# EAGLE design midimixer-channel-rev2 (EAGLE 7.3.0)

## Sheet 1 of 2
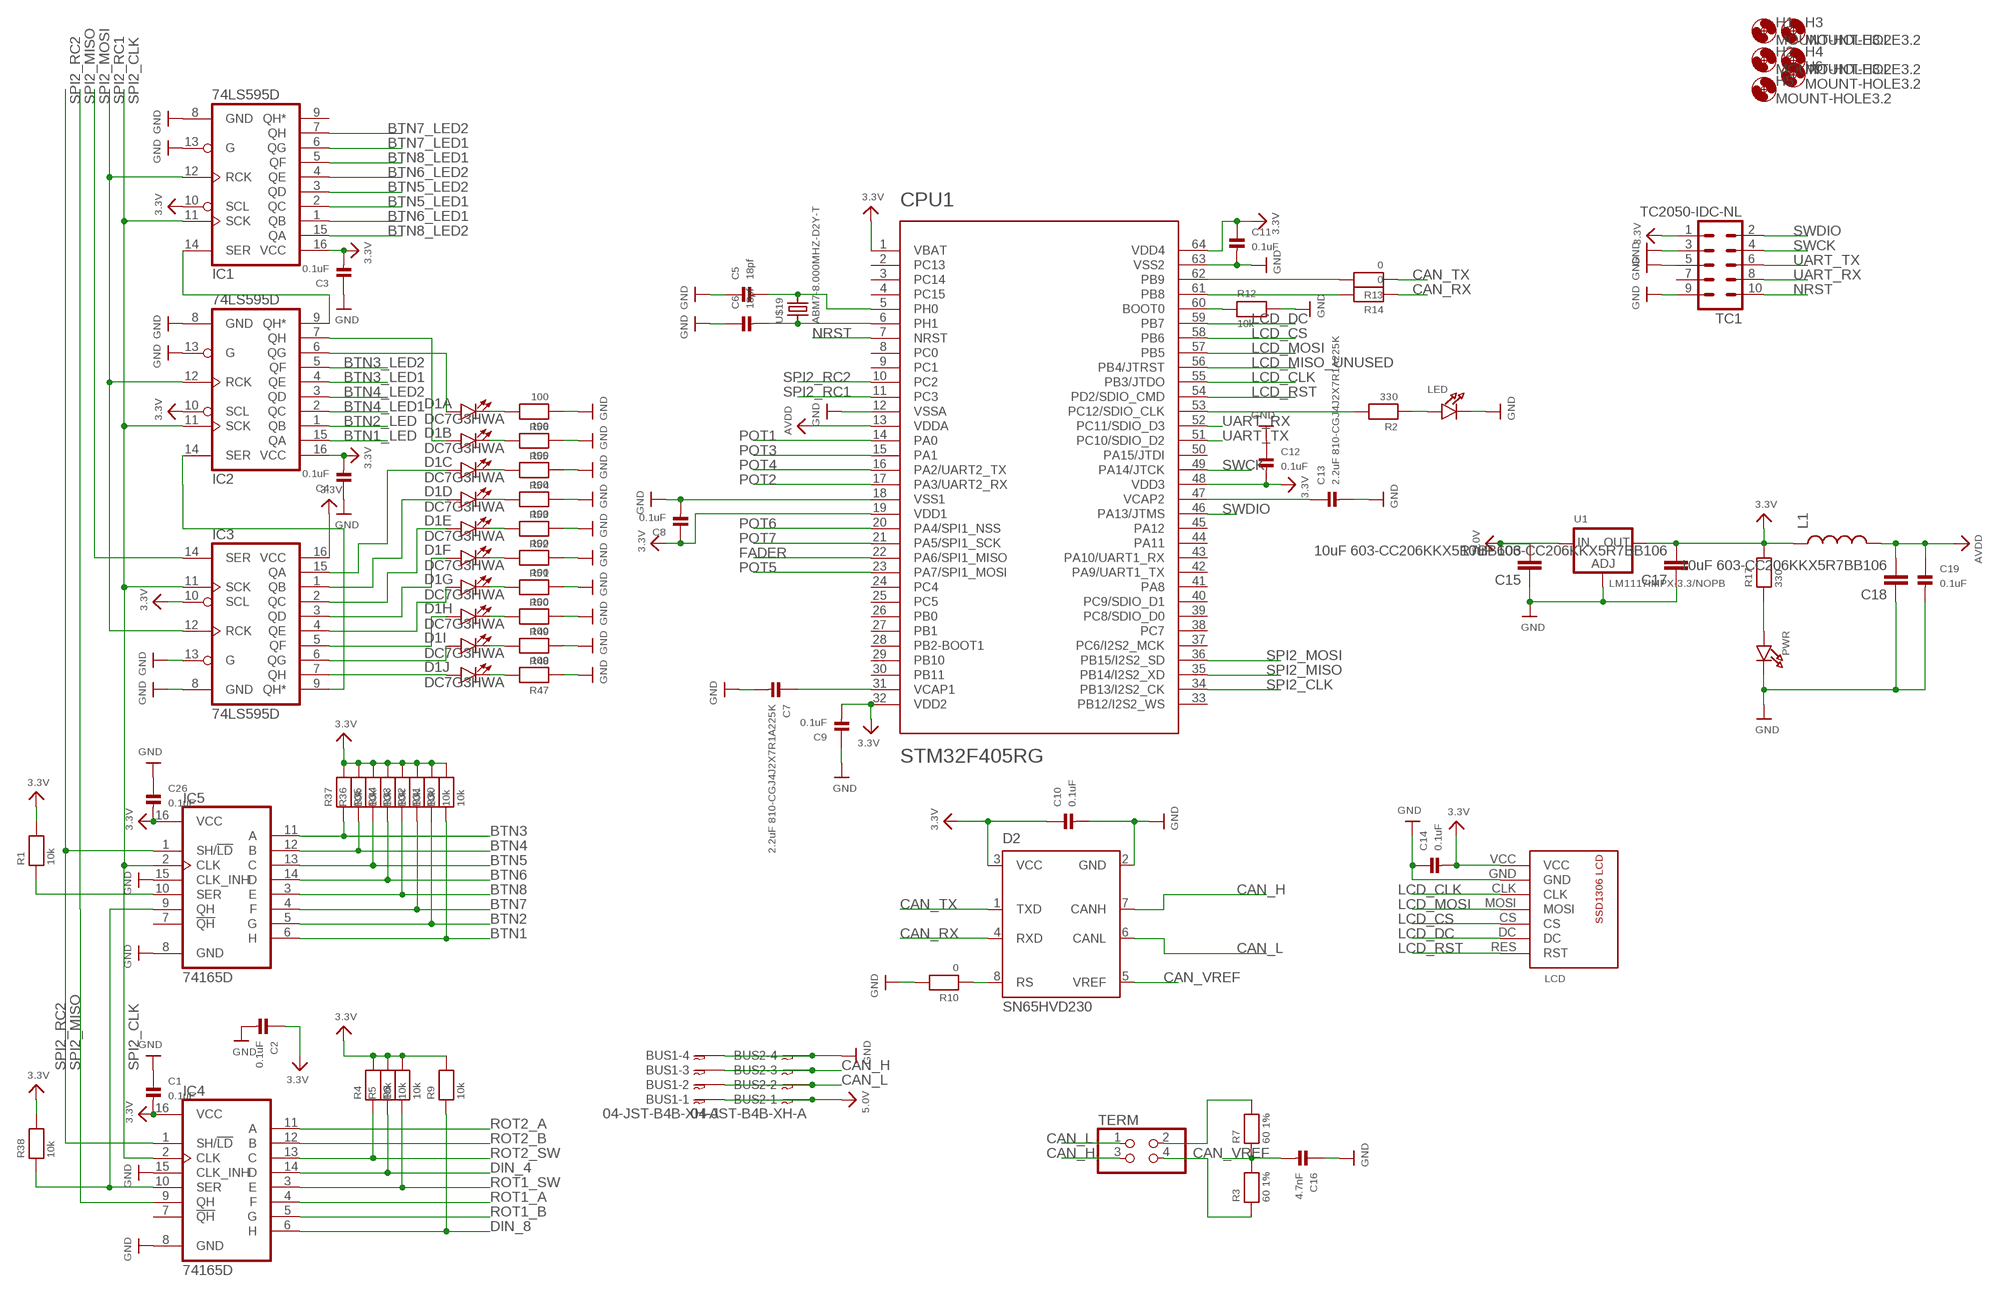
[diagram p0: schematic, sheet 1]

### Parts
BUS1  04-JST-B4B-XH-A  [B4B-XH]
BUS2  04-JST-B4B-XH-A  [B4B-XH]
C1  0.1uF  CAP_CERAMIC0603  [0603]
C2  0.1uF  CAP_CERAMIC0603  [0603]
C3  0.1uF  CAP_CERAMIC0603  [0603]
C4  0.1uF  CAP_CERAMIC0603  [0603]
C5  18pf  CAP_CERAMIC0603  [0603]
C6  18pf  CAP_CERAMIC0603  [0603]
C7  2.2uF 810-CGJ4J2X7R1A225K  CAP_CERAMIC0805  [0805]
C8  0.1uF  CAP_CERAMIC0603  [0603]
C9  0.1uF  CAP_CERAMIC0603  [0603]
C10  0.1uF  CAP_CERAMIC0603  [0603]
C11  0.1uF  CAP_CERAMIC0603  [0603]
C12  0.1uF  CAP_CERAMIC0603  [0603]
C13  2.2uF 810-CGJ4J2X7R1A225K  CAP_CERAMIC0805  [0805]
C14  0.1uF  CAP_CERAMIC0603  [0603]
C15  10uF 603-CC206KKX5R7BB106  CAP1206  [1206]
C16  4.7nF  CAP_CERAMIC0603  [0603]
C17  10uF 603-CC206KKX5R7BB106  CAP1206  [1206]
C18  10uF 603-CC206KKX5R7BB106  CAP1206  [1206]
C19  0.1uF  CAP_CERAMIC0603  [0603]
C26  0.1uF  CAP_CERAMIC0603  [0603]
CPU1  STM32F405RG  [TQFP64]
D1  DC7G3HWA  LED_BARGRAPH_10  [LED_BARGAPH_10]
D2  SN65HVD230  [SO8]
H1  MOUNT-HOLE3.2  [3,2]
H2  MOUNT-HOLE3.2  [3,2]
H3  MOUNT-HOLE3.2  [3,2]
H4  MOUNT-HOLE3.2  [3,2]
H5  MOUNT-HOLE3.2  [3,2]
H6  MOUNT-HOLE3.2  [3,2]
IC1  74LS595D  [SO16]
IC2  74LS595D  [SO16]
IC3  74LS595D  [SO16]
IC4  74165D  [SO16]
IC5  74165D  [SO16]
L1  INDUCTOR0805  [0805]
LCD  SSD1306-7PINWITHOUT-HOLES  [SSD1306-7PIN-NO-HOLES]
LED  LED0603  [CHIPLED_0603]
PWR  LED0603  [CHIPLED_0603]
R1  10k  RESISTOR_0603  [_0603]
R2  330  RESISTOR0603  [0603]
R3  60 1%  RESISTOR0603  [0603]
R4  10k  RESISTOR_0603  [_0603]
R5  10k  RESISTOR_0603  [_0603]
R6  10k  RESISTOR_0603  [_0603]
R7  60 1%  RESISTOR0603  [0603]
R9  10k  RESISTOR_0603  [_0603]
R10  0  RESISTOR_0603  [_0603]
R12  10k  RESISTOR_0603  [_0603]
R13  0  RESISTOR_0603  [_0603]
R14  0  RESISTOR_0603  [_0603]
R17  330  RESISTOR0603  [0603]
R30  10k  RESISTOR_0603  [_0603]
R31  10k  RESISTOR_0603  [_0603]
R32  10k  RESISTOR_0603  [_0603]
R33  10k  RESISTOR_0603  [_0603]
R34  10k  RESISTOR_0603  [_0603]
R35  10k  RESISTOR_0603  [_0603]
R36  10k  RESISTOR_0603  [_0603]
R37  10k  RESISTOR_0603  [_0603]
R38  10k  RESISTOR_0603  [_0603]
R47  100  RESISTOR_0603  [_0603]
R48  100  RESISTOR_0603  [_0603]
R49  100  RESISTOR_0603  [_0603]
R50  100  RESISTOR_0603  [_0603]
R51  100  RESISTOR_0603  [_0603]
R52  100  RESISTOR_0603  [_0603]
R53  100  RESISTOR_0603  [_0603]
R54  100  RESISTOR_0603  [_0603]
R55  100  RESISTOR_0603  [_0603]
R56  100  RESISTOR_0603  [_0603]
TC1  TC2050-IDC-NL  [TC2050-IDC-NL]
TERM  PINHD-2X2  [2X02]
U1  LM1117IMPX-3.3/NOPB  LM1117SOT223-REFLOW  [SOT223-R]
U$19  ABM7-8.000MHZ-D2Y-T  [ABM7-8.000MHZ-D2Y-T]

### Nets
3.3V: C1.2 C2.1 C3.2 C4.2 C8.1 C9.2 C10.1 C11.1 C12.2 C14.2 C17.2 C26.2 CPU1.1(VBAT) CPU1.19(VDD1) CPU1.32(VDD2) CPU1.48(VDD3) CPU1.64(VDD4) D2.3(VCC) IC1.10(SCL) IC1.16(VCC) IC2.10(SCL) IC2.16(VCC) IC3.10(SCL) IC3.16(VCC) IC4.16(VCC) IC5.16(VCC) L1.1 LCD.VCC R1.2 R4.2 R5.2 R6.2 R9.2 R17.2 R30.2 R31.2 R32.2 R33.2 R34.2 R35.2 R36.2 R37.2 R38.2 TC1.1 U1.2(OUT) ; also sheet 2
5.0V: BUS1.P$1 BUS2.P$1 C15.2 U1.3(IN) ; also sheet 2
AVDD: C18.2 C19.1 CPU1.13(VDDA) L1.2
BTN1: IC5.6(H) R30.1 ; also sheet 2
BTN1_LED: IC2.15(QA) ; also sheet 2
BTN2: IC5.5(G) R31.1 ; also sheet 2
BTN2_LED: IC2.1(QB) ; also sheet 2
BTN3: IC5.11(A) R37.1 ; also sheet 2
BTN3_LED1: IC2.4(QE) ; also sheet 2
BTN3_LED2: IC2.5(QF) ; also sheet 2
BTN4: IC5.12(B) R36.1 ; also sheet 2
BTN4_LED1: IC2.2(QC) ; also sheet 2
BTN4_LED2: IC2.3(QD) ; also sheet 2
BTN5: IC5.13(C) R35.1 ; also sheet 2
BTN5_LED1: IC1.2(QC) ; also sheet 2
BTN5_LED2: IC1.3(QD) ; also sheet 2
BTN6: IC5.14(D) R34.1 ; also sheet 2
BTN6_LED1: IC1.1(QB) ; also sheet 2
BTN6_LED2: IC1.4(QE) ; also sheet 2
BTN7: IC5.4(F) R32.1 ; also sheet 2
BTN7_LED1: IC1.6(QG) ; also sheet 2
BTN7_LED2: IC1.7(QH) ; also sheet 2
BTN8: IC5.3(E) R33.1 ; also sheet 2
BTN8_LED1: IC1.5(QF) ; also sheet 2
BTN8_LED2: IC1.15(QA) ; also sheet 2
CAN_H: BUS1.P$3 BUS2.P$3 D2.7(CANH) TERM.3
CAN_L: BUS1.P$2 BUS2.P$2 D2.6(CANL) TERM.1
CAN_RX: D2.4(RXD) R14.1
CAN_TX: D2.1(TXD) R13.1
CAN_VREF: C16.2 D2.5(VREF) R3.2 R7.1
DIN_4: IC4.14(D) R5.1
DIN_8: IC4.6(H) R9.1
FADER: CPU1.22(PA6/SPI1_MISO) ; also sheet 2
GND: BUS1.P$4 BUS2.P$4 C1.1 C2.2 C3.1 C4.1 C5.1 C6.1 C7.2 C8.2 C9.1 C10.2 C11.2 C12.1 C13.2 C14.1 C15.1 C16.1 C17.1 C18.1 C19.2 C26.1 CPU1.12(VSSA) CPU1.18(VSS1) CPU1.63(VSS2) D2.2(GND) IC1.8(GND) IC1.13(G) IC2.8(GND) IC2.13(G) IC3.8(GND) IC3.13(G) IC4.8(GND) IC4.15(CLK_INH) IC5.8(GND) IC5.15(CLK_INH) LCD.GND LED.C PWR.C R10.2 R12.2 R47.1 R48.1 R49.1 R50.1 R51.1 R52.1 R53.1 R54.1 R55.1 R56.1 TC1.3 TC1.5 TC1.9 U1.1(ADJ) ; also sheet 2
LCD_CLK: CPU1.55(PB3/JTDO) LCD.CLK
LCD_CS: CPU1.58(PB6) LCD.CS
LCD_DC: CPU1.59(PB7) LCD.DC
LCD_MISO_UNUSED: CPU1.56(PB4/JTRST)
LCD_MOSI: CPU1.57(PB5) LCD.MOSI
LCD_RST: CPU1.54(PD2/SDIO_CMD) LCD.RES(RST)
N$1: C6.2 CPU1.6(PH1) U$19.P$1
N$2: C5.2 CPU1.5(PH0) U$19.P$2
N$3: C13.1 CPU1.47(VCAP2)
N$4: C7.1 CPU1.31(VCAP1)
N$5: PWR.A R17.1
N$6: CPU1.60(BOOT0) R12.1
N$7: D1.5(E:A) IC3.2(QC)
N$8: D1.2(B:A) IC2.7(QH)
N$11: D1.1(A:A) IC2.6(QG)
N$12: IC1.14(SER) IC2.9(QH*)
N$13: CPU1.62(PB9) R13.2
N$14: D1.11(J:C) R47.2
N$15: D1.12(I:C) R48.2
N$16: D1.13(H:C) R49.2
N$17: D1.14(G:C) R50.2
N$18: D1.15(F:C) R51.2
N$19: D1.16(E:C) R52.2
N$20: D1.17(D:C) R53.2
N$21: D1.18(C:C) R54.2
N$22: D1.19(B:C) R55.2
N$23: D1.20(A:C) R56.2
N$26: IC4.10(SER) IC5.9(QH) R38.1
N$27: CPU1.61(PB8) R14.2
N$28: IC5.10(SER) R1.1
N$31: LED.A R2.1
N$38: D1.10(J:A) IC3.7(QH)
N$41: D1.9(I:A) IC3.6(QG)
N$42: D1.8(H:A) IC3.5(QF)
N$43: CPU1.53(PC12/SDIO_CLK) R2.2
N$46: R7.2 TERM.2
N$47: R3.1 TERM.4
N$52: D1.7(G:A) IC3.4(QE)
N$53: D1.6(F:A) IC3.3(QD)
N$55: D1.4(D:A) IC3.1(QB)
N$56: D1.3(C:A) IC3.15(QA)
N$57: IC2.14(SER) IC3.9(QH*)
N$73: D2.8(RS) R10.1
NRST: CPU1.7(NRST) TC1.10
POT1: CPU1.14(PA0) ; also sheet 2
POT2: CPU1.17(PA3/UART2_RX) ; also sheet 2
POT3: CPU1.15(PA1) ; also sheet 2
POT4: CPU1.16(PA2/UART2_TX) ; also sheet 2
POT5: CPU1.23(PA7/SPI1_MOSI) ; also sheet 2
POT6: CPU1.20(PA4/SPI1_NSS) ; also sheet 2
POT7: CPU1.21(PA5/SPI1_SCK) ; also sheet 2
ROT1_A: IC4.4(F) ; also sheet 2
ROT1_B: IC4.5(G) ; also sheet 2
ROT1_SW: IC4.3(E) R6.1 ; also sheet 2
ROT2_A: IC4.11(A) ; also sheet 2
ROT2_B: IC4.12(B) ; also sheet 2
ROT2_SW: IC4.13(C) R4.1 ; also sheet 2
SPI2_CLK: CPU1.34(PB13/I2S2_CK) IC1.11(SCK) IC2.11(SCK) IC3.11(SCK) IC4.2(CLK) IC5.2(CLK)
SPI2_MISO: CPU1.35(PB14/I2S2_XD) IC4.9(QH)
SPI2_MOSI: CPU1.36(PB15/I2S2_SD) IC3.14(SER)
SPI2_RC1: CPU1.11(PC3) IC1.12(RCK) IC2.12(RCK) IC3.12(RCK)
SPI2_RC2: CPU1.10(PC2) IC4.1(SH/!LD) IC5.1(SH/!LD)
SWCK: CPU1.49(PA14/JTCK) TC1.4
SWDIO: CPU1.46(PA13/JTMS) TC1.2
UART_RX: CPU1.52(PC11/SDIO_D3) TC1.8
UART_TX: CPU1.51(PC10/SDIO_D2) TC1.6
Unconnected: CPU1.2(PC13) CPU1.3(PC14) CPU1.4(PC15) CPU1.8(PC0) CPU1.9(PC1) CPU1.24(PC4) CPU1.25(PC5) CPU1.26(PB0) CPU1.27(PB1) CPU1.28(PB2-BOOT1) CPU1.29(PB10) CPU1.30(PB11) CPU1.33(PB12/I2S2_WS) CPU1.37(PC6/I2S2_MCK) CPU1.38(PC7) CPU1.39(PC8/SDIO_D0) CPU1.40(PC9/SDIO_D1) CPU1.41(PA8) CPU1.42(PA9/UART1_TX) CPU1.43(PA10/UART1_RX) CPU1.44(PA11) CPU1.45(PA12) CPU1.50(PA15/JTDI) IC1.9(QH*) IC4.7(!QH) IC5.7(!QH) TC1.7

## Sheet 2 of 2
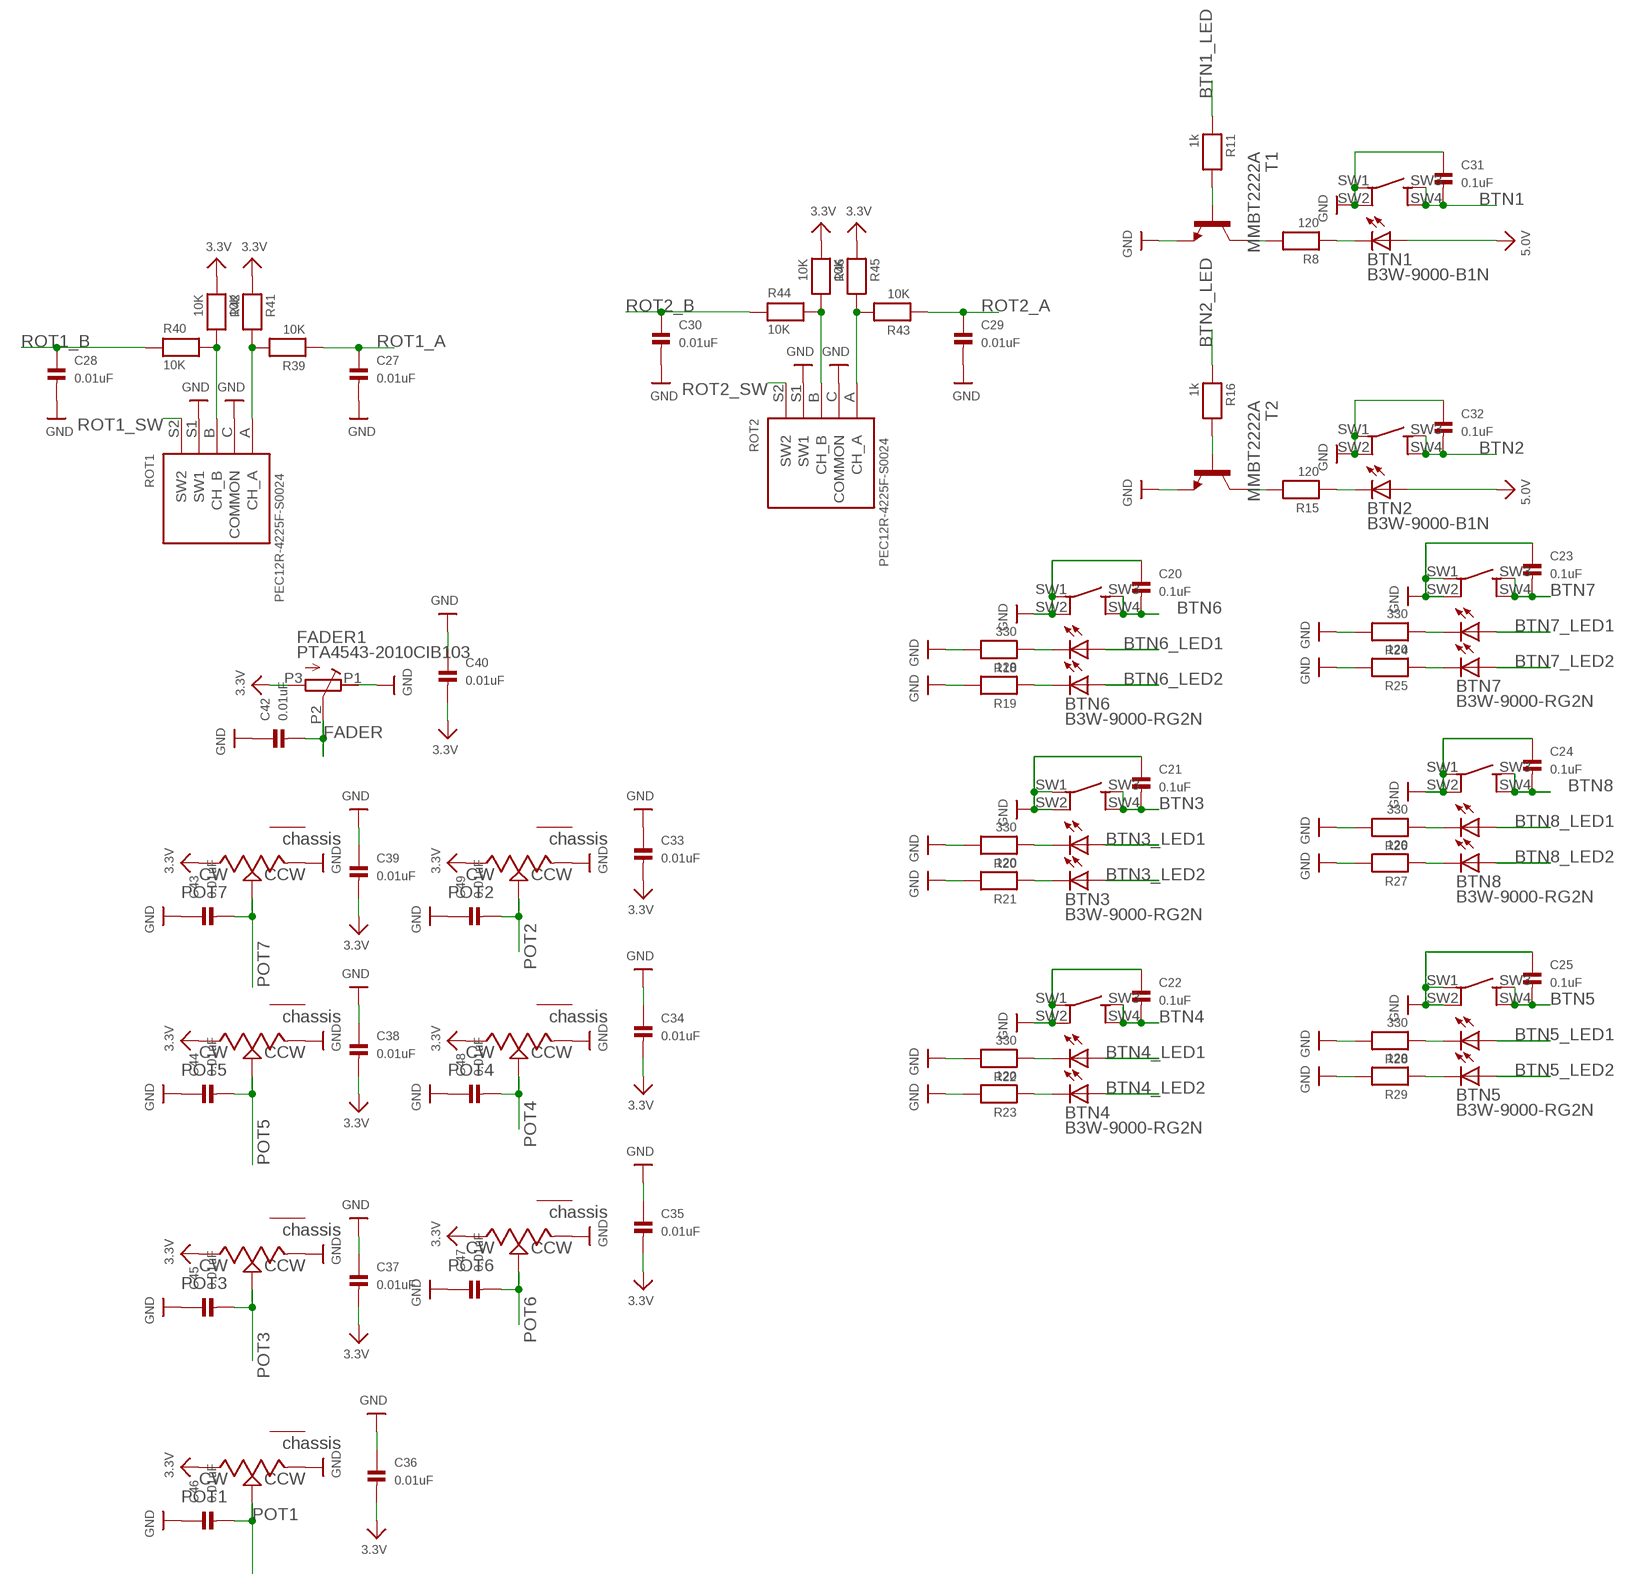
[diagram p1: schematic, sheet 2]

### Parts
BTN1  B3W-9000-B1N  [B3W-9000-X1X]
BTN2  B3W-9000-B1N  [B3W-9000-X1X]
BTN3  B3W-9000-RG2N  [B3W-9000-X2X]
BTN4  B3W-9000-RG2N  [B3W-9000-X2X]
BTN5  B3W-9000-RG2N  [B3W-9000-X2X]
BTN6  B3W-9000-RG2N  [B3W-9000-X2X]
BTN7  B3W-9000-RG2N  [B3W-9000-X2X]
BTN8  B3W-9000-RG2N  [B3W-9000-X2X]
C20  0.1uF  CAP_CERAMIC0603  [0603]
C21  0.1uF  CAP_CERAMIC0603  [0603]
C22  0.1uF  CAP_CERAMIC0603  [0603]
C23  0.1uF  CAP_CERAMIC0603  [0603]
C24  0.1uF  CAP_CERAMIC0603  [0603]
C25  0.1uF  CAP_CERAMIC0603  [0603]
C27  0.01uF  CAP_CERAMIC0603  [0603]
C28  0.01uF  CAP_CERAMIC0603  [0603]
C29  0.01uF  CAP_CERAMIC0603  [0603]
C30  0.01uF  CAP_CERAMIC0603  [0603]
C31  0.1uF  CAP_CERAMIC0603  [0603]
C32  0.1uF  CAP_CERAMIC0603  [0603]
C33  0.01uF  CAP_CERAMIC0603  [0603]
C34  0.01uF  CAP_CERAMIC0603  [0603]
C35  0.01uF  CAP_CERAMIC0603  [0603]
C36  0.01uF  CAP_CERAMIC0603  [0603]
C37  0.01uF  CAP_CERAMIC0603  [0603]
C38  0.01uF  CAP_CERAMIC0603  [0603]
C39  0.01uF  CAP_CERAMIC0603  [0603]
C40  0.01uF  CAP_CERAMIC0603  [0603]
C42  0.01uF  CAP_CERAMIC0603  [0603]
C43  0.01uF  CAP_CERAMIC0603  [0603]
C44  0.01uF  CAP_CERAMIC0603  [0603]
C45  0.01uF  CAP_CERAMIC0603  [0603]
C46  0.01uF  CAP_CERAMIC0603  [0603]
C47  0.01uF  CAP_CERAMIC0603  [0603]
C48  0.01uF  CAP_CERAMIC0603  [0603]
C49  0.01uF  CAP_CERAMIC0603  [0603]
FADER1  PTA4543-2010CIB103  PTA4543-2015CPB103  [PTA4543-2015CPB103]
POT1  POTENTIOMETERPTV09A_VERTICAL  [PTV09A-4]
POT2  POTENTIOMETERPTV09A_VERTICAL  [PTV09A-4]
POT3  POTENTIOMETERPTV09A_VERTICAL  [PTV09A-4]
POT4  POTENTIOMETERPTV09A_VERTICAL  [PTV09A-4]
POT5  POTENTIOMETERPTV09A_VERTICAL  [PTV09A-4]
POT6  POTENTIOMETERPTV09A_VERTICAL  [PTV09A-4]
POT7  POTENTIOMETERPTV09A_VERTICAL  [PTV09A-4]
R8  120  RESISTOR0603  [0603]
R11  1k  RESISTOR0603  [0603]
R15  120  RESISTOR0603  [0603]
R16  1k  RESISTOR0603  [0603]
R18  330  RESISTOR0603  [0603]
R19  120  RESISTOR0603  [0603]
R20  330  RESISTOR0603  [0603]
R21  120  RESISTOR0603  [0603]
R22  330  RESISTOR0603  [0603]
R23  120  RESISTOR0603  [0603]
R24  330  RESISTOR0603  [0603]
R25  120  RESISTOR0603  [0603]
R26  330  RESISTOR0603  [0603]
R27  120  RESISTOR0603  [0603]
R28  330  RESISTOR0603  [0603]
R29  120  RESISTOR0603  [0603]
R39  10K  RESISTOR0603  [0603]
R40  10K  RESISTOR0603  [0603]
R41  10K  RESISTOR0603  [0603]
R42  10K  RESISTOR0603  [0603]
R43  10K  RESISTOR0603  [0603]
R44  10K  RESISTOR0603  [0603]
R45  10K  RESISTOR0603  [0603]
R46  10K  RESISTOR0603  [0603]
ROT1  PEC12R-4225F-S0024  PEC11-4215K-S0024  [PEC111-4XXXK-SXXXX]
ROT2  PEC12R-4225F-S0024  PEC11-4215K-S0024  [PEC111-4XXXK-SXXXX]
T1  MMBT2222A  MMBT2222ALT1-NPN-SOT23-BEC  [SOT23-BEC]
T2  MMBT2222A  MMBT2222ALT1-NPN-SOT23-BEC  [SOT23-BEC]

### Nets
3.3V: C33.2 C34.2 C35.2 C36.2 C37.2 C38.2 C39.2 C40.2 FADER1.P3(E) POT1.CW POT2.CW POT3.CW POT4.CW POT5.CW POT6.CW POT7.CW R41.1 R42.1 R45.1 R46.1 ; also sheet 1
5.0V: BTN1.LED1+ BTN2.LED1+ ; also sheet 1
BTN1: BTN1.SW3(SW2_A) BTN1.SW4(SW2_B) C31.2 ; also sheet 1
BTN1_LED: R11.1 ; also sheet 1
BTN2: BTN2.SW3(SW2_A) BTN2.SW4(SW2_B) C32.2 ; also sheet 1
BTN2_LED: R16.1 ; also sheet 1
BTN3: BTN3.SW3(SW2_A) BTN3.SW4(SW2_B) C21.2 ; also sheet 1
BTN3_LED1: BTN3.LED1+ ; also sheet 1
BTN3_LED2: BTN3.LED2+ ; also sheet 1
BTN4: BTN4.SW3(SW2_A) BTN4.SW4(SW2_B) C22.2 ; also sheet 1
BTN4_LED1: BTN4.LED1+ ; also sheet 1
BTN4_LED2: BTN4.LED2+ ; also sheet 1
BTN5: BTN5.SW3(SW2_A) BTN5.SW4(SW2_B) C25.2 ; also sheet 1
BTN5_LED1: BTN5.LED1+ ; also sheet 1
BTN5_LED2: BTN5.LED2+ ; also sheet 1
BTN6: BTN6.SW3(SW2_A) BTN6.SW4(SW2_B) C20.2 ; also sheet 1
BTN6_LED1: BTN6.LED1+ ; also sheet 1
BTN6_LED2: BTN6.LED2+ ; also sheet 1
BTN7: BTN7.SW3(SW2_A) BTN7.SW4(SW2_B) C23.2 ; also sheet 1
BTN7_LED1: BTN7.LED1+ ; also sheet 1
BTN7_LED2: BTN7.LED2+ ; also sheet 1
BTN8: BTN8.SW3(SW2_A) BTN8.SW4(SW2_B) C24.2 ; also sheet 1
BTN8_LED1: BTN8.LED1+ ; also sheet 1
BTN8_LED2: BTN8.LED2+ ; also sheet 1
FADER: C42.2 FADER1.P2(S) ; also sheet 1
GND: BTN1.SW1(SW1_A) BTN1.SW2(SW1_B) BTN2.SW1(SW1_A) BTN2.SW2(SW1_B) BTN3.SW1(SW1_A) BTN3.SW2(SW1_B) BTN4.SW1(SW1_A) BTN4.SW2(SW1_B) BTN5.SW1(SW1_A) BTN5.SW2(SW1_B) BTN6.SW1(SW1_A) BTN6.SW2(SW1_B) BTN7.SW1(SW1_A) BTN7.SW2(SW1_B) BTN8.SW1(SW1_A) BTN8.SW2(SW1_B) C20.1 C21.1 C22.1 C23.1 C24.1 C25.1 C27.2 C28.2 C29.2 C30.2 C31.1 C32.1 C33.1 C34.1 C35.1 C36.1 C37.1 C38.1 C39.1 C40.1 C42.1 C43.1 C44.1 C45.1 C46.1 C47.1 C48.1 C49.1 FADER1.P1(A) POT1.CCW POT2.CCW POT3.CCW POT4.CCW POT5.CCW POT6.CCW POT7.CCW R18.2 R19.2 R20.2 R21.2 R22.2 R23.2 R24.2 R25.2 R26.2 R27.2 R28.2 R29.2 ROT1.C(COMMON) ROT1.S1(SW1) ROT2.C(COMMON) ROT2.S1(SW1) T1.E T2.E ; also sheet 1
N$9: BTN6.LED1- R18.1
N$10: BTN6.LED2- R19.1
N$24: BTN3.LED1- R20.1
N$25: BTN3.LED2- R21.1
N$29: BTN7.LED1- R24.1
N$30: BTN7.LED2- R25.1
N$32: R40.2 R42.2 ROT1.B(CH_B)
N$33: R39.2 R41.2 ROT1.A(CH_A)
N$34: BTN8.LED1- R26.1
N$35: BTN8.LED2- R27.1
N$36: R44.2 R46.2 ROT2.B(CH_B)
N$37: R43.2 R45.2 ROT2.A(CH_A)
N$39: BTN4.LED1- R22.1
N$40: BTN4.LED2- R23.1
N$44: BTN5.LED1- R28.1
N$45: BTN5.LED2- R29.1
N$48: BTN2.LED1- R15.1
N$49: BTN1.LED1- R8.1
N$50: R8.2 T1.C
N$51: R11.2 T1.B
N$54: R15.2 T2.C
N$58: R16.2 T2.B
POT1: C46.2 POT1.CENTER(WIPER) ; also sheet 1
POT2: C49.2 POT2.CENTER(WIPER) ; also sheet 1
POT3: C45.2 POT3.CENTER(WIPER) ; also sheet 1
POT4: C48.2 POT4.CENTER(WIPER) ; also sheet 1
POT5: C44.2 POT5.CENTER(WIPER) ; also sheet 1
POT6: C47.2 POT6.CENTER(WIPER) ; also sheet 1
POT7: C43.2 POT7.CENTER(WIPER) ; also sheet 1
ROT1_A: C27.1 R39.1 ; also sheet 1
ROT1_B: C28.1 R40.1 ; also sheet 1
ROT1_SW: ROT1.S2(SW2) ; also sheet 1
ROT2_A: C29.1 R43.1 ; also sheet 1
ROT2_B: C30.1 R44.1 ; also sheet 1
ROT2_SW: ROT2.S2(SW2) ; also sheet 1
Unconnected: POT1.4(CHASSIS) POT2.4(CHASSIS) POT3.4(CHASSIS) POT4.4(CHASSIS) POT5.4(CHASSIS) POT6.4(CHASSIS) POT7.4(CHASSIS)

## Library data of the parts
BTN1 BTN2 = keves:B3W-9000-B1N
BTN3-BTN8 = keves:B3W-9000-RG2N
BUS1 BUS2 = bt_con-jst-xh:04-JST: JST CONNECTOR; MPN: B4B-XH-A(LF)(SN)
C1-C6 C8-C12 C14 C16 C19-C40 C42-C49 = microbuilder:CAP_CERAMIC: Ceramic Capacitors 0402 - 0402 Surface Mount Capacitors 16pF 50V 5% [Digikey: 445-4899-2-ND] 18pF 50V 5% [Digikey: 490-1281-2-ND] 22pF 50V 5% [Digikey: 490-1283-2-ND] 68pF 50V 5% [Digikey: 490-1289-2-ND] 0.1uF 10V 10% [Digikey: 490-1318-2-ND] 1.0uF 6.3V 10% [Digikey: 490-1320-2-ND] 0603 - 0603 Surface Mount Capacitors 16 pF 50V 5% [Digikey: 445-5051-2-ND] 22 pF 50V [Digikey: PCC220ACVTR-ND] 33 pF 50V 5% [Digikey: 490-1415-1-ND] 56pF 50V 5% [Digikey: 490-1421-1-ND] 220pF 50V 5% [Digikey: 445-1285-1-ND] 680 pF 50V 2200 pF 50V 5% C0G [Digikey: 445-1297-1-ND] 5600 pF 100V 5% X7R [Digikey: 478-3711-1-ND] 0.1 µF 25V 10% [Digikey: PCC2277TR-ND] 0.22 µF 16V 10% X7R [Digikey: 445-1318-1-ND] 1.0 µF 25V 10% [Digikey: 445-5146-2-ND] 0603 - RF Specific 3pF 250V +/-0.1pF RF [Digikey: 712-1347-1-ND] 18 pF 250V 5% [Digikey: 478-3505-1-ND or 712-1322-1-ND] 56 pF 250V 5% C0G RF [Digikey: 490-4867-1-ND] 68 pF 250V RF [Digikey: 490-4868-1-ND] 0805 - 0805 Surface Mount Capacitors 220 pF 250V 2% RF Ceramic Capacitor [Digikey: 712-1398-1-ND] 1000 pF 50V 2% NP0 Ceramic Capacitor [Digikey: 478-3760-1-ND] 0.1 µF 25V 10% Ceramic Capacitor [Digikey: PCC1828TR-ND] 1.0 µF 16V 10% Ceramic Capacitor[Digikey: 490-1691-2-ND] 10.0 µF 10V 10% Ceramic Capacitor[Digikey: 709-1228-1-ND] 10.0 uF 16V 10% Ceramic Capacitor [Digikey: 478-5165-2-ND] 47 uF 6.3V 20% Ceramic Capacitor [Digikey: 587-1779-1-ND or 399-5506-1-ND] 1206 - 1206 Surface Mount Capacitors 47uF 10V 20% Ceramic Capacitor [Digikey: 490-5528-1-ND or 399-5508-1-ND or 445-6010-1-ND] 100uF 6.3V -20%, +80% Y5V Ceramic Capacitor (Digikey: 490-4512-1-ND, Mouser: 81-GRM31CF50J107ZE1L)
C7 C13 = microbuilder:CAP_CERAMIC: Ceramic Capacitors 0402 - 0402 Surface Mount Capacitors 16pF 50V 5% [Digikey: 445-4899-2-ND] 18pF 50V 5% [Digikey: 490-1281-2-ND] 22pF 50V 5% [Digikey: 490-1283-2-ND] 68pF 50V 5% [Digikey: 490-1289-2-ND] 0.1uF 10V 10% [Digikey: 490-1318-2-ND] 1.0uF 6.3V 10% [Digikey: 490-1320-2-ND] 0603 - 0603 Surface Mount Capacitors 16 pF 50V 5% [Digikey: 445-5051-2-ND] 22 pF 50V [Digikey: PCC220ACVTR-ND] 33 pF 50V 5% [Digikey: 490-1415-1-ND] 56pF 50V 5% [Digikey: 490-1421-1-ND] 220pF 50V 5% [Digikey: 445-1285-1-ND] 680 pF 50V 2200 pF 50V 5% C0G [Digikey: 445-1297-1-ND] 5600 pF 100V 5% X7R [Digikey: 478-3711-1-ND] 0.1 µF 25V 10% [Digikey: PCC2277TR-ND] 0.22 µF 16V 10% X7R [Digikey: 445-1318-1-ND] 1.0 µF 25V 10% [Digikey: 445-5146-2-ND] 0603 - RF Specific 3pF 250V +/-0.1pF RF [Digikey: 712-1347-1-ND] 18 pF 250V 5% [Digikey: 478-3505-1-ND or 712-1322-1-ND] 56 pF 250V 5% C0G RF [Digikey: 490-4867-1-ND] 68 pF 250V RF [Digikey: 490-4868-1-ND] 0805 - 0805 Surface Mount Capacitors 220 pF 250V 2% RF Ceramic Capacitor [Digikey: 712-1398-1-ND] 1000 pF 50V 2% NP0 Ceramic Capacitor [Digikey: 478-3760-1-ND] 0.1 µF 25V 10% Ceramic Capacitor [Digikey: PCC1828TR-ND] 1.0 µF 16V 10% Ceramic Capacitor[Digikey: 490-1691-2-ND] 10.0 µF 10V 10% Ceramic Capacitor[Digikey: 709-1228-1-ND] 10.0 uF 16V 10% Ceramic Capacitor [Digikey: 478-5165-2-ND] 47 uF 6.3V 20% Ceramic Capacitor [Digikey: 587-1779-1-ND or 399-5506-1-ND] 1206 - 1206 Surface Mount Capacitors 47uF 10V 20% Ceramic Capacitor [Digikey: 490-5528-1-ND or 399-5508-1-ND or 445-6010-1-ND] 100uF 6.3V -20%, +80% Y5V Ceramic Capacitor (Digikey: 490-4512-1-ND, Mouser: 81-GRM31CF50J107ZE1L); MPN: CGJ4J2X7R1A225K125AA
C15 C17 C18 = SparkFun-Passives:CAP: Capacitor Standard 0603 ceramic capacitor, and 0.1" leaded capacitor.; MPN: CC1206KKX5R7BB106
CPU1 = SparkFun-DigitalIC:STM32F405RG: ARM DSP Chip used on the WAV Trigger board.; MPN: STM32F405RGT6
D1 = SparkFun-LED:LED_BARGRAPH_10: 10-Segment LED Bar Graph SFE part numbers: COM-09935 (red, Vf = 2.1V, Ifmax = 20mA) COM-09936 (yellow, Vf = 2.1V, Ifmax = 20mA) COM-09937 (blue, Vf = 3.4V, Ifmax = 20mA) COM-09938 (green, Vf = 3.4V, Ifmax = 20mA)
D2 = omc:SN65HVD230: SN65HVD230 - 3.3V CAN Transceiver - 3.3V operation - ISO 11898 compliant - up to 1Mbps - up to 120 nodes - listen only mode - slope control; MPN: SN65HVD230DR
FADER1 = keves:PTA4543-2015CPB103
H1-H6 = holes:MOUNT-HOLE: MOUNTING HOLE with drill center marker; POPULATE: 0
IC1-IC3 = SparkFun-DigitalIC:74*595: 8-bit SHIFT REGISTER, output latch; MPN: 74HC595D,118; PROD_ID: IC-07875
IC4 IC5 = SparkFun-DigitalIC:74*165; MPN: 74HC165D,653
L1 = SparkFun-Passives:INDUCTOR: Inductors Basic Inductor/Choke - 0603 and 1206. Footprints are not proven and vary greatly between part numbers. INDUCTOR POWER 3.3UH 4.0A SMD 0.197" L x 0.197" W x 0.177" H (5.00mm x 5.00mm x 4.50mm); MPN: 2508056017Y2
LCD = keves:SSD1306-7PIN: https://www.aliexpress.com/item/free-shipping-0-96-inch-OLED-display-module-128X64-OLED-For-arduino-I2C-IIC-SPI-7p/32595065668.html?ws_ab_test=searchweb0_0,searchweb201602_1_116_117_10065_10068_114_10067_115_10069_113_10017_10080_10082_10081_10060_10061_10062_10056_10055_10054_10059_10078_10079_10073_10070_10052_10053_10050_10051,searchweb201603_6&btsid=51ed1bae-6cee-4f36-9ddd-1a85c2e0ff68; POPULATE: 0
LED PWR = microbuilder:LED: LED 0603 - 0603 Surface Mount Package 2mA: Green LED - Low Power (3.9mcd, 2ma, 1.7Vf) - Digikey: 475-2709-2-ND Orange LED - Low Power (9.8mcd, 2ma, 1.8Vf) - Digikey: 475-1194-2-ND Red LED - Low Power (5mcd, 2ma, 1.8Vf) - Digikey: 475-1195-2-ND Yellow LED - Low Power (7mcd, 2ma, 1.8Vf) - Digikey: 475-1196-2-ND 5mA: Blue LED - Low Power (17mcd, 5ma, 2.9Vf) - Digikey: LNJ937W8CRACT-ND 0805 - 0805 Surface Mount Package 2mA: Red LED (8.8mcd, 2mA, 1.8Vf, Clear) - Low Power [Digikey: 475-2510-1-ND] Green LED (5mcd, 2mA, 1.8Vf, Clear) - Low Power [Digikey: 475-2730-1-ND] Yellow LED (11.3mcd, 2mA, 1.8Vf, Clear) - Low Power [Digikey: 475-2555-1-ND] 20mA: Red LED (104mcd, 20mA, Diffused) - LS R976 [Digikey: 475-1278-6-ND] Red LED (12mcd, 20mA, 2.0Vf, Clear) - APT2012EC [Digikey: 754-1128-1-ND] Green LED (15mcd, 20mA, 2.2Vf, Clear) - APT2012GC [Digikey: 754-1131-1-ND] Orange LED (160mcd, 20mA, 2.1Vf, Clear) - APT2012SECK [Digikey: 754-1130-1-ND] 1206 - 1206 Surface Mount Package Green LED (26mcd, 20mA, Diffused) - LG N971 [Digikey: 475-1407-6-ND] Red LED (15mcd, 20mA, Diffused) - LH N974 [Digikey: 475-1416-6-ND]; MPN: MF-LED-0603-GREEN
POT1-POT7 = keves:POTENTIOMETER; MPN: PTV09A-4225F-B203; POPULATE: 0
R1 R2 R4-R6 R8-R56 = microbuilder:RESISTOR: Resistors 0402 - 0402 Surface Mount Package 22 Ohm 1% 1/16W [Digikey: 311-22.0LRTR-ND] 33 Ohm 5% 1/16W 1.0K 5% 1/16W 1.5K 5% 1/16W 2.0K 1% 1/16W 10.0K 1% 1/16W [Digikey: 311-10.0KLRTR-ND] 10.0K 5% 1/16W [Digikey: RMCF0402JT10K0TR-ND] 12.1K 1% 1/16W [Digikey: 311-22.0LRTR-ND] 100.0K 5% 1/16W 0603 - 0603 Surface Mount Package 0 Ohm 1/10 Watt 1% Resistor 15 Ohm 1/10 Watt 1% Resistor 33 Ohm 1/10 Watt 1% Resistor 49.9 Ohm 1/10 Watt 1% Resistor 100 Ohm 1/10 Watt 1% Resistor 150 Ohm 1/10 Watt 1% Resistor 240 Ohm 1/10 Watt 1% Resistor 390 Ohm 1/10 Watt 1% Resistor 560 Ohm 1/10 Watt 1% Resistor 680 Ohm 1/10 Watt 1% Resistor 750 Ohm 1/10 Watt 1% Resistor 1.0K Ohm 1/10 Watt 1% Resistor 1.5K Ohm 1/10 Watt 1% Resistor 2.0K Ohm 1/10 Watt 1% Resistor 2.2K Ohm 1/10 Watt 1% Resistor 3.3K Ohm 1/10 Watt 1% Resistor 4.7K Ohm 1/10 Watt 1% Resistor 10.0K Ohm 1/10 Watt 1% Resistor 12.0K Ohm 1/10 Watt 1% Resistor 12.1K Ohm 1/10 Watt 1% Resistor 20.0K Ohm 1/10 Watt 1% Resistor 33.0K Ohm 1/10 Watt 1% Resistor 100.0K Ohm 1/10 Watt 1% Resistor 0805 - 0805 Surface Mount Package 0 Ohm 1/8 Watt 1% Resistor 33 Ohm 1/8 Watt 1% Resistor 100 Ohm 1/8 Watt 1% Resistor 150 Ohm 1/8 Watt 1% Resistor 200 Ohm 1/8 Watt 1% Resistor 240 Ohm 1/8 Watt 1% Resistor 330 Ohm 1/8 Watt 1% Resistor 390 Ohm 1/8 Watt 1% Resistor 470 Ohm 1/8 Watt 1% Resistor 1.0K Ohm 1/8 Watt 1% Resistor 1.5K Ohm 1/8 Watt 1% Resistor 2.0K Ohm 1/8 Watt 1% Resistor 4.7K Ohm 1/8 Watt 1% Resistor 5.1K Ohm 1/8 Watt 1% Resistor 5.6K Ohm 1/8 Watt 1% Resistor 10.0K Ohm 1/8 Watt 1% Resistor 22.0K Ohm 1/8 Watt 1% Resistor 33.0K Ohm 1/8 Watt 1% Resistor 100K Ohm 1/8 Watt 1% Resistor 1206 - 1206 Surface Mount Package 2012 - 2010 Surface Mount Package 0.11 Ohm 1/2 Watt 1% Resistor - Digikey: RHM.11UCT-ND
R3 R7 = microbuilder:RESISTOR: Resistors 0402 - 0402 Surface Mount Package 22 Ohm 1% 1/16W [Digikey: 311-22.0LRTR-ND] 33 Ohm 5% 1/16W 1.0K 5% 1/16W 1.5K 5% 1/16W 2.0K 1% 1/16W 10.0K 1% 1/16W [Digikey: 311-10.0KLRTR-ND] 10.0K 5% 1/16W [Digikey: RMCF0402JT10K0TR-ND] 12.1K 1% 1/16W [Digikey: 311-22.0LRTR-ND] 100.0K 5% 1/16W 0603 - 0603 Surface Mount Package 0 Ohm 1/10 Watt 1% Resistor 15 Ohm 1/10 Watt 1% Resistor 33 Ohm 1/10 Watt 1% Resistor 49.9 Ohm 1/10 Watt 1% Resistor 100 Ohm 1/10 Watt 1% Resistor 150 Ohm 1/10 Watt 1% Resistor 240 Ohm 1/10 Watt 1% Resistor 390 Ohm 1/10 Watt 1% Resistor 560 Ohm 1/10 Watt 1% Resistor 680 Ohm 1/10 Watt 1% Resistor 750 Ohm 1/10 Watt 1% Resistor 1.0K Ohm 1/10 Watt 1% Resistor 1.5K Ohm 1/10 Watt 1% Resistor 2.0K Ohm 1/10 Watt 1% Resistor 2.2K Ohm 1/10 Watt 1% Resistor 3.3K Ohm 1/10 Watt 1% Resistor 4.7K Ohm 1/10 Watt 1% Resistor 10.0K Ohm 1/10 Watt 1% Resistor 12.0K Ohm 1/10 Watt 1% Resistor 12.1K Ohm 1/10 Watt 1% Resistor 20.0K Ohm 1/10 Watt 1% Resistor 33.0K Ohm 1/10 Watt 1% Resistor 100.0K Ohm 1/10 Watt 1% Resistor 0805 - 0805 Surface Mount Package 0 Ohm 1/8 Watt 1% Resistor 33 Ohm 1/8 Watt 1% Resistor 100 Ohm 1/8 Watt 1% Resistor 150 Ohm 1/8 Watt 1% Resistor 200 Ohm 1/8 Watt 1% Resistor 240 Ohm 1/8 Watt 1% Resistor 330 Ohm 1/8 Watt 1% Resistor 390 Ohm 1/8 Watt 1% Resistor 470 Ohm 1/8 Watt 1% Resistor 1.0K Ohm 1/8 Watt 1% Resistor 1.5K Ohm 1/8 Watt 1% Resistor 2.0K Ohm 1/8 Watt 1% Resistor 4.7K Ohm 1/8 Watt 1% Resistor 5.1K Ohm 1/8 Watt 1% Resistor 5.6K Ohm 1/8 Watt 1% Resistor 10.0K Ohm 1/8 Watt 1% Resistor 22.0K Ohm 1/8 Watt 1% Resistor 33.0K Ohm 1/8 Watt 1% Resistor 100K Ohm 1/8 Watt 1% Resistor 1206 - 1206 Surface Mount Package 2012 - 2010 Surface Mount Package 0.11 Ohm 1/2 Watt 1% Resistor - Digikey: RHM.11UCT-ND; MPN: MF-RES-0603-60.4
ROT1 ROT2 = keves:PEC11-4215K-S0024
T1 T2 = transistor:*-NPN-: NPN Transistror BF959 corrected 2008.03.06
TC1 = TagConnect:TC2050-IDC: Tag-Connect In Circuit Programming & Debug Cable 10 Pin http://www.tag-connect.com; POPULATE: 0
TERM = pinhead:PINHD-2X2: PIN HEADER; MPN: 5-146254-2
U1 = microbuilder:LM1117: LM1117 Voltage Regulator LM1117 Adjustable Voltage regulator [Digikey: LM1117IMP-ADJDKR-ND] LM1117 3.3V Voltage regulator [AP1117E33GDIDKR-ND] LM1117 5.0V Voltage regulator [AP1117E50GDIDKR-ND] SOT223-REFLOW - SOT223 package for solder paste/reflow ovens SOT223-WAVE - SOT223 package for hand-soldering (larger pads) Note: For the fixed-voltage regulators, simply set the ADJ pin to GND.; MPN: LM1117MPX-3.3/NOPB
U$19 = keves:ABM7-8.000MHZ-D2Y-T

## Board
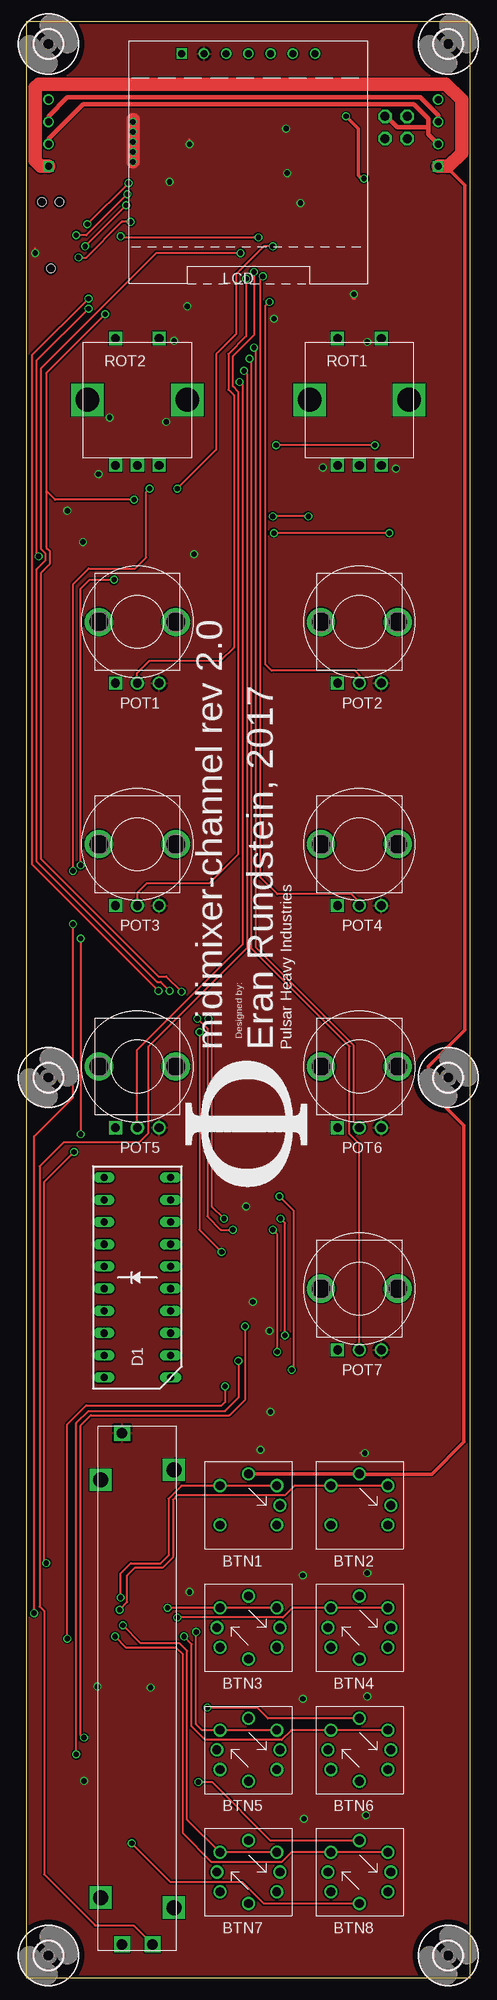
[diagram p2: board, top side]
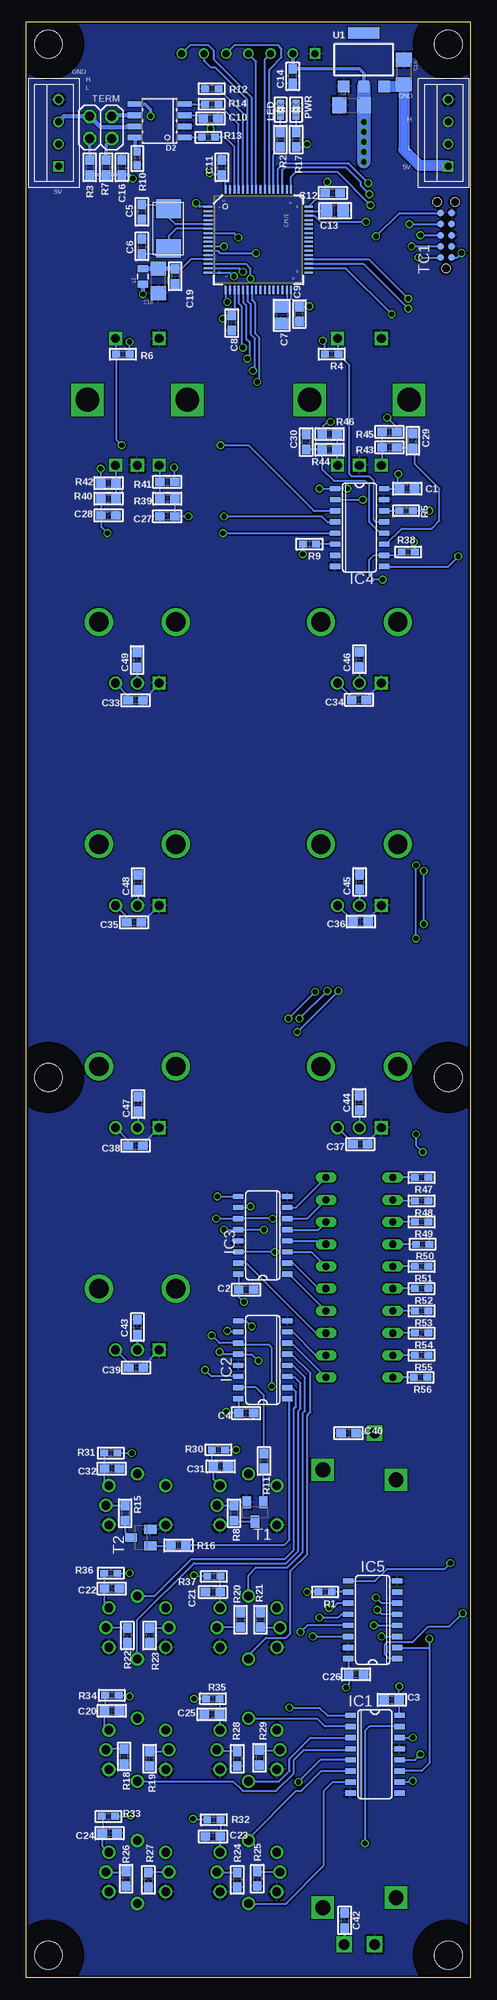
[diagram p3: board, bottom side, seen from below]

Size 50.8 x 223.52 mm. Coordinates in mm from the lower left corner, seen from the top.
Outline: 0,0 50.8,0 50.8,223.52 0,223.52 0,0
Copper layers (1*16): Top 0.035mm / dielectric 1.5mm / Bottom 0.035mm
Design rules "MacroFab_Standard_2_Layer *": minimum track width 6mil, minimum drill 12mil, track to track 6mil, track to pad 6mil, pad to pad 6mil, via to via 6mil, smd to smd 0mil, copper to edge 10mil, drill to drill 10mil, minimum pad ring 6mil, minimum via ring 6mil, stop-mask expansion 2mil, vias tented up to drill 25mil, thermal gap 10mil

### Footprints (pad centres in the part's own frame; a part is rotated, then mirrored left to right if it is on the bottom)
B3W-9000-X1X = drill 1: LED1+ 0,3.6; LED1- 3.6,0; SW1 3.25,-2.25; SW2 -3.25,-2.25; SW3 3.25,2.25; SW4 -3.25,2.25
B3W-9000-X2X = drill 1: LED1+ 0,3.6; LED1- 3.6,0; LED2+ 0,-3.6; LED2- -3.6,0; SW1 3.25,-2.25; SW2 -3.25,-2.25; SW3 3.25,2.25; SW4 -3.25,2.25
B4B-XH = drill 0.8 square: P$1 -3.81,0 | drill 0.8: P$2 -1.27,0; P$3 1.27,0; P$4 3.81,0
0603 = smd 1.1 x 1: 1 -0.85,0; 2 0.85,0
0805 = smd 1.3 x 1.5: 1 -0.95,0; 2 0.95,0
1206 = smd 1.6 x 1.8: 1 -1.4,0; 2 1.4,0
TQFP64 = smd 0.22 x 1: 1 -3.75,-5.75; 2 -3.25,-5.75; 3 -2.75,-5.75; 4 -2.25,-5.75; 5 -1.75,-5.75; 6 -1.25,-5.75; 7 -0.75,-5.75; 8 -0.25,-5.75; 9 0.25,-5.75; 10 0.75,-5.75; 11 1.25,-5.75; 12 1.75,-5.75; 13 2.25,-5.75; 14 2.75,-5.75; 15 3.25,-5.75; 16 3.75,-5.75; 33 3.75,5.75; 34 3.25,5.75; 35 2.75,5.75; 36 2.25,5.75; 37 1.75,5.75; 38 1.25,5.75; 39 0.75,5.75; 40 0.25,5.75; 41 -0.25,5.75; 42 -0.75,5.75; 43 -1.25,5.75; 44 -1.75,5.75; 45 -2.25,5.75; 46 -2.75,5.75; 47 -3.25,5.75; 48 -3.75,5.75 | smd 1 x 0.22: 17 5.75,-3.75; 18 5.75,-3.25; 19 5.75,-2.75; 20 5.75,-2.25; 21 5.75,-1.75; 22 5.75,-1.25; 23 5.75,-0.75; 24 5.75,-0.25; 25 5.75,0.25; 26 5.75,0.75; 27 5.75,1.25; 28 5.75,1.75; 29 5.75,2.25; 30 5.75,2.75; 31 5.75,3.25; 32 5.75,3.75; 49 -5.75,3.75; 50 -5.75,3.25; 51 -5.75,2.75; 52 -5.75,2.25; 53 -5.75,1.75; 54 -5.75,1.25; 55 -5.75,0.75; 56 -5.75,0.25; 57 -5.75,-0.25; 58 -5.75,-0.75; 59 -5.75,-1.25; 60 -5.75,-1.75; 61 -5.75,-2.25; 62 -5.75,-2.75; 63 -5.75,-3.25; 64 -5.75,-3.75
LED_BARGAPH_10 = drill 0.813 long: 1 -11.43,-3.81; 2 -8.89,-3.81; 3 -6.35,-3.81; 4 -3.81,-3.81; 5 -1.27,-3.81; 6 1.27,-3.81; 7 3.81,-3.81; 8 6.35,-3.81; 9 8.89,-3.81; 10 11.43,-3.81; 11 11.43,3.81; 12 8.89,3.81; 13 6.35,3.81; 14 3.81,3.81; 15 1.27,3.81; 16 -1.27,3.81; 17 -3.81,3.81; 18 -6.35,3.81; 19 -8.89,3.81; 20 -11.43,3.81
SO8 = smd 0.65 x 1.75: 1 -1.905,-2.8; 2 -0.635,-2.8; 3 0.635,-2.8; 4 1.905,-2.8; 5 1.905,2.8; 6 0.635,2.8; 7 -0.635,2.8; 8 -1.905,2.8
PTA4543-2015CPB103 = drill 1.2 square: P1 -29.21,1.74; P2 -29.21,-1.74; P3 29.21,1.74 | drill 1.7 square: P$1 -23.876,4.191; P$2 23.876,4.191; P$3 -25.019,-4.191; P$4 25.019,-4.191
3,2 = hole 3.2: 0,0
SO16 = smd 0.6 x 1.2: 1 -4.445,-2.8; 2 -3.175,-2.8; 3 -1.905,-2.8; 4 -0.635,-2.8; 5 0.635,-2.8; 6 1.905,-2.8; 7 3.175,-2.8; 8 4.445,-2.8; 9 4.445,2.8; 10 3.175,2.8; 11 1.905,2.8; 12 0.635,2.8; 13 -0.635,2.8; 14 -1.905,2.8; 15 -3.175,2.8; 16 -4.445,2.8
0805' = smd 0.8 x 1.2: 1 -0.9,0; 2 0.9,0
SSD1306-7PIN-NO-HOLES = drill 0.8: CLK -2.54,24.3; CS 7.62,24.3; DC 5.08,24.3; MOSI 0,24.3; RES 2.54,24.3; VCC -5.08,24.3 | drill 0.8 square: GND -7.62,24.3
CHIPLED_0603 = smd 0.8 x 0.8: A 0,-0.75; C 0,0.75
PTV09A-4 = drill 2.2: 4 -4.4,0; 5 4.4,0 | drill 1 square: CCW -2.5,-7 | drill 1: CENTER 0,-7; CW 2.5,-7
_0603 = smd 0.9 x 0.8: 1 -0.762,0; 2 0.762,0
PEC111-4XXXK-SXXXX = drill 1 square: A -2.5,-7.5; B 2.5,-7.5; C 0,-7.5; S1 -2.5,7; S2 2.5,7 | drill 2.7 square: P$1 -5.7,0; P$2 5.7,0
SOT23-BEC = smd 1 x 1.4: B -0.95,-1.1; C 0,1.1; E 0.95,-1.1
TC2050-IDC-NL = smd 0.787 x 0.787: 1 -2.54,-0.635; 2 -2.54,0.635; 3 -1.27,-0.635; 4 -1.27,0.635; 5 0,-0.635; 6 0,0.635; 7 1.27,-0.635; 8 1.27,0.635; 9 2.54,-0.635; 10 2.54,0.635 | hole 0.991: -3.81,0; 3.81,1.016; 3.81,-1.016
2X02 = drill 1.016 octagon: 1 -1.27,-1.27; 2 -1.27,1.27; 3 1.27,-1.27; 4 1.27,1.27
SOT223-R = smd 1.3 x 1.3: 1 -2.3,-3.05; 2 0,-3.05; 3 2.3,-3.05 | smd 3.6 x 1.3: 4 0,3.05
ABM7-8.000MHZ-D2Y-T = smd 2.159 x 2.845: P$1 -2.273,0; P$2 2.273,0

### Placement (x,y rotation side)
BTN1  25.4,53.98 0 top
BTN2  38.1,53.98 0 top
BTN3  25.4,40.01 0 top
BTN4  38.1,40.01 0 top
BTN5  25.4,26.04 0 top
BTN6  38.1,26.04 0 top
BTN7  25.4,12.06 0 top
BTN8  38.1,12.06 0 top
BUS1  2.54,210.82 90 bottom
BUS2  47.12,210.82 90 bottom
C1  7.24,170.18 180 bottom
C2  25.65,78.61 0 bottom
C3  9.02,31.75 0 bottom
C4  25.65,64.52 180 bottom
C5  37.59,201.8 90 bottom
C6  37.59,197.87 270 bottom
C7  21.59,189.99 270 bottom
C8  27.3,189.1 270 bottom
C9  19.56,190.12 90 bottom
C10  29.72,212.47 0 bottom
C11  28.45,206.88 90 bottom
C12  15.75,203.96 180 bottom
C13  15.49,201.93 0 bottom
C14  20.32,217.3 90 bottom
C15  7.62,217.81 270 bottom
C16  39.88,206.88 270 bottom
C17  13.59,214 0 bottom
C18  35.69,193.93 90 bottom
C19  33.78,194.44 270 bottom
C20  41.02,30.48 180 bottom
C21  29.46,44.07 0 bottom
C22  41.02,44.45 180 bottom
C23  29.46,16.13 0 bottom
C24  41.27,16.51 180 bottom
C25  29.59,30.1 0 bottom
C26  13.08,34.67 180 bottom
C27  34.67,167 180 bottom
C28  41.4,167.13 0 bottom
C29  6.6,175.64 90 bottom
C30  18.8,175.51 90 bottom
C31  28.57,58.42 180 bottom
C32  41.02,58.17 180 bottom
C33  38.3,145.97 180 bottom
C34  12.75,146.05 180 bottom
C35  38.48,120.62 180 bottom
C36  12.55,120.7 180 bottom
C37  12.6,95.25 180 bottom
C38  38.3,95.07 180 bottom
C39  38.25,69.72 180 bottom
C40  13.94,62.23 0 bottom
C42  14.4,6.53 270 bottom
C43  38.1,74.35 270 bottom
C44  12.73,99.97 270 bottom
C45  12.67,125.22 270 bottom
C46  12.7,150.67 270 bottom
C47  38.02,99.85 270 bottom
C48  38.02,125.2 270 bottom
C49  38.13,150.6 270 bottom
CPU1  24.26,198.63 270 bottom
D1  12.7,80.01 90 top
D2  35.56,212.22 90 bottom
FADER1  12.7,33.02 90 top
H1  48.26,2.54 0 top
H2  2.54,220.98 0 top
H3  2.54,2.54 0 top
H4  48.26,220.98 0 top
H5  2.54,102.87 0 top
H6  48.26,102.87 0 top
IC1  10.92,25.53 270 bottom
IC2  23.75,70.61 90 bottom
IC3  23.75,84.84 90 bottom
IC4  12.7,165.74 270 bottom
IC5  11.18,40.89 90 bottom
L1  [0805']  37.47,194.44 90 bottom
LCD  25.4,195.58 0 top
LED  21.72,213.49 0 bottom
POT1  12.7,154.94 0 top
POT2  38.1,154.94 0 top
POT3  12.7,129.54 0 top
POT4  38.1,129.54 0 top
POT5  12.7,104.14 0 top
POT6  38.1,104.14 0 top
POT7  38.1,78.74 0 top
PWR  19.94,213.49 0 bottom
R1  16.64,44.07 180 bottom
R2  21.72,210.06 270 bottom
R3  43.56,206.88 270 bottom
R4  15.88,185.55 180 bottom
R5  7.37,167.64 0 bottom
R6  39.75,185.55 0 bottom
R7  41.66,206.88 90 bottom
R8  200  [0603]  27.05,53.09 270 bottom
R9  18.41,163.83 180 bottom
R10  38.1,207.9 270 bottom
R11  23.62,59.05 270 bottom
R12  29.59,215.9 180 bottom
R13  29.97,210.31 0 bottom
R14  29.59,214.12 0 bottom
R15  200  [0603]  39.5,53.09 270 bottom
R16  33.4,49.4 180 bottom
R17  19.94,210.06 270 bottom
R18  39.62,25.27 270 bottom
R19  36.7,25.02 270 bottom
R20  26.29,40.89 90 bottom
R21  24,40.89 90 bottom
R22  39.24,39.12 270 bottom
R23  36.7,39.12 270 bottom
R24  26.67,11.18 270 bottom
R25  24.38,11.3 270 bottom
R26  39.37,11.3 270 bottom
R27  36.83,11.18 270 bottom
R28  26.67,25.02 270 bottom
R29  24.13,25.15 270 bottom
R30  28.83,60.33 0 bottom
R31  41.15,59.94 0 bottom
R32  29.34,18.03 180 bottom
R33  41.4,18.41 0 bottom
R34  41.02,32.26 0 bottom
R35  29.46,31.88 180 bottom
R36  41.15,46.23 0 bottom
R37  29.34,45.85 180 bottom
R38  7.11,162.94 0 bottom
R39  34.67,169.04 180 bottom
R40  41.4,169.04 0 bottom
R41  34.67,170.94 180 bottom
R42  41.4,170.81 0 bottom
R43  9.27,174.88 180 bottom
R44  16.13,174.62 0 bottom
R45  9.27,176.66 180 bottom
R46  16.13,176.4 0 bottom
R47  5.59,91.44 180 bottom
R48  5.59,88.77 180 bottom
R49  5.59,86.36 180 bottom
R50  5.46,83.82 180 bottom
R51  5.59,81.28 180 bottom
R52  5.59,78.74 180 bottom
R53  5.59,76.2 180 bottom
R54  5.59,73.66 180 bottom
R55  5.59,71.12 180 bottom
R56  5.71,68.58 180 bottom
ROT1  38.1,180.34 0 top
ROT2  12.7,180.34 0 top
T1  24.64,53.21 180 bottom
T2  37.72,50.29 90 bottom
TC1  2.79,199.14 90 bottom
TERM  42.29,211.46 180 bottom
U1  12.19,219.2 0 bottom
U$19  34.54,199.9 90 bottom

### Tracks (layer width: path | path; a pad name or v marks a point on that pad's centre or on a via)
3.3V  (via drill 0.6)
  Top 0.254: v31.37,202.82 31.62,203.07 | v29.84,206.25 29.97,206.38 | v18.41,191.01 18.16,191.01 | v28.32,189.61 28.45,189.48 | v18.67,209.55 18.67,210.06 | v16.38,205.23 16.26,205.36 | v1.02,197.1 1.02,197.61 | v42.29,172.47 42.29,172.85 | v33.91,172.59 33.91,172.72 | v8.26,171.83 8.13,171.96 | v9.53,178.31 9.53,178.44 | v16,177.8 15.75,177.8 | v19.18,162.69 19.18,162.43 | v6.48,164.08 6.48,164.21 6.6,164.34 | v16.89,187.07 17.02,187.2 | v38.99,186.94 38.99,187.07 | v4.7,167.64 4.32,167.64 | v14.22,33.15 14.35,33.02 | v18.67,44.07 18.92,44.07 | v31.62,45.97 31.88,45.97 32,46.1 | v38.99,46.23 38.73,46.23 | v38.73,59.94 38.23,59.94 | v26.8,60.33 26.54,60.33 | v27.94,64.64 27.94,64.77 28.07,64.9 | v25.91,77.22 25.53,77.22 | v25.15,88.14 25.02,88.14 24.89,88.27 | v31.62,31.88 31.75,31.88 | v38.99,32.13 38.86,32.13 | v38.86,18.54 38.61,18.54 38.48,18.41 | v31.75,18.16 31.88,18.16 | v8.13,33.27 8.13,33.53 | v6.6,22.48 6.48,22.48
  Top 0.508: v37.47,192.41 37.47,192.02
  Top 1.524: v12.19,207.52 v12.19,208.66 v12.19,209.8 v12.19,210.95 v12.19,212.09 12.19,212.34
  Bottom 0.254: D2.3 30.95,212.85 C10.1 30.57,212.18 v29.72,211.33 | CPU1.1 30.93,202.38 v31.37,202.82 | v29.84,206.25 29.63,206.03 C11.1 28.01,205.59 CPU1.64 | CPU1.32 20.51,191.92 C9.2 18.45,190.97 v18.41,191.01 | v28.32,189.61 27.98,189.95 C8.1 27.01,190.25 CPU1.19 | R17.2 19.01,209.21 v18.67,209.55 | CPU1.48 16.92,203.96 C12.2 16.6,205.02 v16.38,205.23 | TC1.1 1.52,196.6 v1.02,197.1 | R42.1 42.25,172.43 v42.29,172.47 | R41.1 33.82,172.5 v33.91,172.59 | IC4.16 8.29,170.18 | 8.29,170.18 C1.2 | 8.29,170.18 8.29,171.79 v8.26,171.83 | R45.1 8.42,177.2 v9.53,178.31 | v16,177.8 16.38,177.8 16.89,177.29 16.89,176.49 R46.1 | R9.2 v19.18,162.69 | R38.2 6.35,163.96 v6.48,164.08 | R4.2 16.64,186.82 v16.89,187.07 | R6.2 v38.99,186.94 | R5.2 v4.7,167.64 | IC5.16 13.98,34.72 C26.2 13.93,33.44 v14.22,33.15 | R1.2 v18.67,44.07 | R37.2 31.5,45.85 v31.62,45.97 | R36.2 v38.99,46.23 | R31.2 v38.73,59.94 | R30.2 v26.8,60.33 | IC2.16 26.55,64.56 C4.2 27.81,64.52 v27.94,64.64 | IC3.16 26.55,78.66 C2.1 26.5,77.81 v25.91,77.22 | IC3.10 25.27,88.01 v25.15,88.14 | R35.2 v31.62,31.88 | R34.2 39.12,32.26 v38.99,32.13 | R33.2 38.99,18.41 v38.86,18.54 | R32.2 31.62,18.03 v31.75,18.16 | v8.13,33.27 8.17,33.23 C3.2 8.17,30.02 IC1.16 | IC1.10 6.73,22.35 v6.6,22.48 | IC2.10 27.69,73.79 v27.81,73.91 | C39.2 39.1,70.24 POT7.CW | C38.2 39.15,95.69 POT6.CW | C37.2 13.45,95.39 POT5.CW | C35.2 39.33,121.27 POT4.CW | C36.2 13.4,120.74 POT3.CW | C34.2 13.6,146.34 POT1.CW | C33.2 39.15,146.49 POT2.CW
  Bottom 0.406: LCD.VCC C14.2 20.28,218.19 12.7,218.19 12.19,217.68 U1.2 | C40.2 FADER1.P3
  Bottom 0.508: L1.1 v37.47,192.41
  Bottom 1.524: U1.2 C17.2 v12.19,207.52
  pour Top: -9.4,225.68 -9.02,-1.4 50.29,-1.52 56.77,8.13 56.52,225.04
5.0V
  Top 0.406: BUS2.P$1 48.01,207.01 50.16,204.85 50.16,108.33 45.97,104.14 45.97,101.47 50.04,97.41 50.04,61.21 46.35,57.53 38.14,57.53 BTN2.LED1+ BTN1.LED1+
  Top 1.524: BUS1.P$1 1.65,207.01 1.02,207.65 1.02,216.03 1.4,216.41 48.01,216.41 49.78,214.63 49.78,208.53 48.26,207.01 BUS2.P$1
  Bottom 1.27: U1.3 7.87,216.15 C15.2 7.62,208.91 5.84,207.14 2.67,207.14 BUS1.P$1
AVDD
  Bottom 0.254: CPU1.13 31.97,196.38 33.02,195.33 33.74,195.33 C19.1
  Bottom 0.508: C19.1 35.65,195.29 C18.2 37.46,195.33 L1.2
BTN1  (via drill 0.6)
  Top 0.254: BTN1.SW3 BTN1.SW4 17.74,56.23 16.26,54.74 16.26,48.26 15.37,47.37 11.94,47.37 10.79,46.23 v10.79,43.43
  Bottom 0.254: IC5.6 10.16,42.8 v10.79,43.43 | R30.1 29.59,58.59 C31.2 29.43,57 BTN1.SW3
BTN1_LED
  Bottom 0.254: R11.1 23.62,66.55 24.51,67.44 IC2.15
BTN2  (via drill 0.6)
  Top 0.254: BTN2.SW3 BTN2.SW4 30.7,56.23 29.59,55.12 17.27,55.12 16.76,54.61 16.76,48.01 15.62,46.86 12.45,46.86 11.56,45.97 11.56,42.93 v10.67,42.04
  Bottom 0.254: IC5.5 10.16,41.53 v10.67,42.04 | R31.1 41.91,58.2 C32.2 41.87,56.75 BTN2.SW3
BTN2_LED
  Bottom 0.254: R16.1 21.34,49.4 20.7,50.04 20.7,65.92 IC2.1
BTN3  (via drill 0.6)
  Top 0.254: BTN3.SW3 BTN3.SW4 v16.16,42.26
  Bottom 0.254: IC5.11 15.24,42.8 15.78,42.26 v16.16,42.26 | BTN3.SW3 28.65,44.03 C21.2 28.61,45.81 R37.1
BTN3_LED1
  Bottom 0.254: BTN3.LED1+ 25.4,45.97 24.51,46.86 20.95,46.86 19.18,48.64 19.18,64.52 18.92,64.77 18.92,68.58 20.32,69.98 IC2.4
BTN3_LED2
  Bottom 0.254: BTN3.LED2+ 25.4,36.83 23.37,38.86 21.08,38.86 20.57,39.37 20.57,46.48 18.67,48.39 18.67,64.26 18.29,64.64 18.29,69.09 20.45,71.25 IC2.5
BTN4  (via drill 0.6)
  Top 0.254: BTN4.SW3 BTN4.SW4 30.44,42.26 29.34,41.15 v17.27,41.15
  Bottom 0.254: v17.27,41.15 15.11,41.15 14.73,41.53 IC5.12 | R36.1 41.91,44.49 C22.2 41.87,42.78 BTN4.SW3
BTN4_LED1
  Bottom 0.254: BTN4.LED1+ 36.15,43.6 31.88,47.88 21.21,47.88 20.19,48.9 20.19,65.02 19.94,65.28 19.94,66.93 20.45,67.44 IC2.2
BTN4_LED2
  Bottom 0.254: BTN4.LED2+ 38.1,40.89 31.62,47.37 21.08,47.37 19.68,48.77 19.68,64.77 19.43,65.02 19.43,67.94 20.07,68.58 20.82,68.58 IC2.3
BTN5  (via drill 0.6)
  Top 0.254: BTN5.SW3 BTN5.SW4 20.1,28.29 19.43,28.96 v19.43,39.5
  Bottom 0.254: IC5.13 18.67,40.26 v19.43,39.5 | R35.1 28.7,30.14 C25.2 28.65,30.01 BTN5.SW3
BTN5_LED1
  Bottom 0.254: BTN5.LED1+ 17.57,29.64 16.64,28.7 IC1.2
BTN5_LED2
  Bottom 0.254: BTN5.LED2+ 21.89,22.43 20.7,23.62 20.7,25.02 18.29,27.43 IC1.3
BTN6  (via drill 0.6)
  Top 0.254: BTN6.SW3 BTN6.SW4 30.32,28.29 29.21,27.18 20.45,27.18 18.92,28.7 18.92,38.1 v18.03,38.99
  Bottom 0.254: v18.03,38.99 IC5.14 | R34.1 41.78,30.57 C20.2 41.87,28.81 BTN6.SW3
BTN6_LED1  (via drill 0.6)
  Top 0.254: BTN6.LED1+ 27.64,29.64 26.42,30.86 v20.7,30.86
  Bottom 0.254: v20.7,30.86 17.27,30.86 16.38,29.97 IC1.1
BTN6_LED2
  Bottom 0.254: BTN6.LED2+ 27.13,22.43 26.04,21.34 22.23,21.34 20.19,23.37 20.19,24.89 19.05,26.04 13.85,26.04 IC1.4
BTN7  (via drill 0.6)
  Top 0.254: BTN7.SW3 BTN7.SW4 18.41,18.05 18.41,37.34 17.53,38.23 13.08,38.23 v11.05,40.26
  Bottom 0.254: v11.05,40.26 IC5.4 | R32.1 28.57,16.17 C23.2 28.61,14.35 BTN7.SW3
BTN7_LED1
  Bottom 0.254: BTN7.LED1+ 25.4,15.88 19.94,21.34 19.3,21.34 17.02,23.62 IC1.6
BTN7_LED2
  Bottom 0.254: BTN7.LED2+ 21.13,8.46 16.76,12.83 16.76,21.34 15.75,22.35 IC1.7
BTN8  (via drill 0.6)
  Top 0.254: BTN8.SW3 BTN8.SW4 30.32,14.31 29.21,13.21 21.21,13.21 17.91,16.51 17.91,36.96 17.14,37.72 11.43,37.72 v10.16,38.99
  Bottom 0.254: v10.16,38.99 IC5.3 | R33.1 42.04,18.29 42.04,16.26 42.16,16.38 42.12,16.42 C24.2 42.12,15.09 BTN8.SW3
BTN8_LED1  (via drill 0.6)
  Top 0.254: BTN8.LED1+ 27.94,15.66 21.25,22.35 v19.68,22.35
  Bottom 0.254: IC1.5 17.14,24.89 v19.68,22.35
BTN8_LED2  (via drill 0.6)
  Top 0.254: BTN8.LED2+ 27.18,8.46 24.72,10.92 16.51,10.92 v12.06,15.37
  Bottom 0.254: IC1.15 11.56,28.7 12.06,28.19 v12.06,15.37
CAN_H
  Top 0.508: BUS1.P$3 2.54,212.72 4.7,214.88 45.09,214.88 47.12,212.85 BUS2.P$3
  Bottom 0.508: D2.7 39.24,211.58 39.37,211.46 42.29,211.46 TERM.3 46.48,212.72 BUS2.P$3
CAN_L
  Top 0.508: BUS1.P$2 2.54,210.19 6.48,214.12 44.32,214.12 45.97,212.47 45.97,211.33 | 45.97,211.33 45.97,210.69 BUS2.P$2 | TERM.1 41.15,212.72 42.42,211.46 45.85,211.46 45.97,211.33
  Bottom 0.508: D2.6 40.89,212.85 TERM.1
CAN_RX
  Bottom 0.254: D2.4 R14.1
CAN_TX
  Bottom 0.254: D2.1 R13.1
CAN_VREF  (via drill 0.6)
  Top 0.406: v38.61,205.61 38.35,205.61 37.97,205.99 37.97,211.33 v36.58,212.72
  Bottom 0.406: R3.2 R7.1 C16.2 39.03,206.03 v38.61,205.61 | v36.58,212.72 36.58,213.49 37.21,214.12 D2.5
DIN_4
  Bottom 0.254: IC4.14 R5.1
DIN_8
  Bottom 0.254: IC4.6 R9.1
FADER  (via drill 0.6)
  Top 0.254: v24.89,183.64 25.27,183.26 25.27,117.73 13.97,106.43 13.97,96.52 12.95,95.5 4.32,95.5 1.52,92.71 1.52,42.42 2.03,41.91 2.03,11.81 7.87,5.97 12.28,5.97 FADER1.P2
  Bottom 0.254: v24.89,183.64 24.64,183.9 24.64,187.32 25.15,187.83 25.15,191.26 25.51,191.62 CPU1.22 | C42.2 14.4,3.85 FADER1.P2
GND
  Bottom 0.254: C39.1 37.4,69.94 POT7.CCW | C38.1 37.45,95.29 POT6.CCW | C37.1 11.75,95.59 POT5.CCW | C35.1 37.52,120.62 POT4.CCW | C36.1 11.7,121.04 POT3.CCW | C34.1 11.9,146.24 POT1.CCW | POT2.CCW 35.65,147.94 35.66,147.96 35.66,147.76 C33.1
  pour Bottom: -6.86,223.52 -6.86,-0.89 49.91,-1.14 54.99,8.89 54.86,224.92
LCD_CLK
  Bottom 0.254: CPU1.55 23.51,219.23 LCD.CLK
LCD_CS
  Bottom 0.254: CPU1.58 25.01,214.87 29.34,219.2 29.34,220.22 29.97,220.85 32.05,220.85 LCD.CS
LCD_DC
  Bottom 0.254: CPU1.59 25.51,214.61 29.21,218.31 29.72,218.31 30.48,219.07 LCD.DC
LCD_MOSI
  Bottom 0.254: CPU1.57 24.51,218.99 LCD.MOSI
LCD_RST
  Bottom 0.254: CPU1.54 23.01,218.04 21.59,219.46 21.59,220.47 21.97,220.85 26.97,220.85 LCD.RES
N$1
  Bottom 0.254: CPU1.6 33.67,199.88 34.54,199.01 34.54,198.25 | 34.54,198.25 U$19.P$1 | C6.2 35.77,197.02 34.54,198.25
N$2
  Bottom 0.254: CPU1.5 33.75,200.38 34.54,201.17 U$19.P$2 35.03,202.65 C5.2
N$3
  Bottom 0.254: CPU1.47 16.5,201.88 C13.1
N$4
  Bottom 0.254: CPU1.31 21.01,191.53 C7.1
N$5
  Bottom 0.254: PWR.A R17.1
N$6
  Bottom 0.254: CPU1.60 26.01,213.08 R12.1
N$7
  Bottom 0.254: D1.5 17.4,78.74 20.32,81.66 IC3.2
N$8
  Bottom 0.254: D1.2 17.65,71.12 20.32,73.79 IC2.7
N$9
  Bottom 0.254: R18.1 41.61,26.12 BTN6.LED1-
N$10
  Bottom 0.254: R19.1 34.67,25.87 BTN6.LED2-
N$11
  Bottom 0.254: D1.1 20.45,72.52 IC2.6
N$12  (via drill 0.6)
  Top 0.254: v6.6,27.43 6.48,27.43 6.22,27.69 6.22,63.12 7.37,64.26 23.24,64.26 25.02,66.04 v25.02,74.42
  Bottom 0.254: IC1.14 v6.6,27.43 | IC2.9 25.65,75.06 v25.02,74.42
N$13
  Bottom 0.254: CPU1.62 27.01,209.25 28.07,210.31 R13.2
N$14
  Bottom 0.254: R47.2 D1.11
N$15
  Bottom 0.254: R48.2 8.76,88.77 D1.12
N$16
  Bottom 0.254: R49.2 D1.13
N$17
  Bottom 0.254: R50.2 D1.14
N$18
  Bottom 0.254: R51.2 D1.15
N$19
  Bottom 0.254: R52.2 D1.16
N$20
  Bottom 0.254: R53.2 D1.17
N$21
  Bottom 0.254: R54.2 D1.18
N$22
  Bottom 0.254: R55.2 D1.19
N$23
  Bottom 0.254: R56.2 D1.20
N$24
  Bottom 0.254: R20.1 28.96,40.04 BTN3.LED1-
N$25
  Bottom 0.254: R21.1 21.84,40.04 BTN3.LED2-
N$26  (via drill 0.6)
  Top 0.254: v2.29,47.37 2.03,47.62 2.03,90.93 v5.46,94.36 | v10.03,159.77 7.24,159.77 6.22,158.75 v6.22,127.13 | v6.22,118.75 v6.22,96.39
  Bottom 0.254: R38.1 8.26,162.56 IC4.10 11.05,162.56 11.56,162.05 11.56,160.27 11.05,159.77 v10.03,159.77 | IC5.9 10.92,45.34 9.53,46.74 2.92,46.74 v2.29,47.37 | v5.46,94.36 6.22,95.12 v6.22,96.39 | v6.22,118.75 v6.22,127.13
N$27
  Bottom 0.254: CPU1.61 26.51,211.8 R14.2
N$28
  Bottom 0.254: IC5.10 R1.1
N$29
  Bottom 0.254: BTN7.LED1- 26.71,12.06 R24.1
N$30
  Bottom 0.254: BTN7.LED2- 24.3,12.06 R25.1
N$31
  Bottom 0.254: R2.1 LED.A
N$32
  Bottom 0.254: R40.2 R42.2 40.55,172.79 ROT1.B
N$33
  Bottom 0.254: R39.2 R41.2 35.52,172.76 ROT1.A
N$34
  Bottom 0.254: BTN8.LED1- 39.46,12.06 R26.1
N$35
  Bottom 0.254: BTN8.LED2- 36.79,12.06 R27.1
N$36
  Bottom 0.254: R46.2 R44.2 15.28,172.92 ROT2.B
N$37
  Bottom 0.254: R45.2 R43.2 10.12,172.92 ROT2.A
N$38
  Bottom 0.254: IC3.7 19.94,88.01 D1.10
N$39
  Bottom 0.254: R22.1 41.66,39.97 BTN4.LED1-
N$40
  Bottom 0.254: R23.1 34.54,39.97 BTN4.LED2-
N$41
  Bottom 0.254: IC3.6 18.67,86.74 D1.9
N$42
  Bottom 0.254: IC3.5 17.4,85.47 D1.8
N$43
  Bottom 0.254: CPU1.53 22.51,208.42 R2.2
N$44
  Bottom 0.254: R28.1 28.83,25.87 BTN5.LED1-
N$45
  Bottom 0.254: R29.1 21.84,26 BTN5.LED2-
N$46
  Bottom 0.406: R7.2 41.66,209.55 TERM.2
N$47
  Bottom 0.406: R3.1 TERM.4
N$48
  Bottom 0.254: R15.1 41.66,53.94 BTN2.LED1-
N$49
  Bottom 0.254: R8.1 28.96,53.94 BTN1.LED1-
N$50
  Bottom 0.254: T1.C 26.93,52.11 R8.2
N$51
  Bottom 0.254: T1.B 23.69,58.14 R11.2
N$52
  Bottom 0.254: IC3.4 16.89,84.2 D1.7
N$53
  Bottom 0.254: IC3.3 18.16,82.93 D1.6
N$54
  Bottom 0.254: R15.2 39.5,50.97 T2.C
N$55
  Bottom 0.254: IC3.1 20.7,80.39 D1.4
N$56
  Bottom 0.254: D1.3 17.65,73.66 25.65,81.66 IC3.15
N$57  (via drill 0.6)
  Top 0.254: v30.35,69.47 30.61,69.72 30.61,87.63 v28.96,89.28
  Bottom 0.254: IC2.14 29.59,68.71 v30.35,69.47 | v28.96,89.28 IC3.9
N$58
  Bottom 0.254: T2.B 34.31,49.34 R16.2
N$73
  Bottom 0.406: D2.8 38.36,208.92 R10.1
NRST  (via drill 0.6)
  Top 0.254: v26.54,198.88 10.92,198.88 v10.79,199.01
  Bottom 0.254: CPU1.7 27.04,199.38 v26.54,198.88 | v10.79,199.01 8.13,201.68 TC1.10
POT1  (via drill 0.6)
  Top 0.254: POT1.CENTER 12.7,149.1 14.1,150.5 22.23,150.5 23.75,152.02 23.75,180.85 23.11,181.48 23.11,185.55 25.15,187.58 v25.15,194.18
  Bottom 0.254: CPU1.14 25.7,195.88 25.15,195.33 v25.15,194.18 | C46.2 POT1.CENTER
POT2  (via drill 0.6)
  Top 0.254: POT2.CENTER 38.1,148.84 37.59,149.35 28.07,149.35 27.3,150.11 27.3,191.01 v27.81,191.52
  Bottom 0.254: CPU1.17 28.01,191.71 v27.81,191.52 | C49.2 38.12,148.69 38.1,148.67 POT2.CENTER
POT3  (via drill 0.6)
  Top 0.254: POT3.CENTER 12.7,122.56 | v26.04,194.94 26.04,187.71 23.62,185.29 23.62,181.86 24.26,181.23 24.26,128.4 20.95,125.09 13.84,125.09 12.7,123.95 12.7,122.56 | 12.7,122.56 12.68,122.53 12.65,122.53
  Bottom 0.254: CPU1.15 26.47,195.38 v26.04,194.94 | C45.2 12.68,122.56 POT3.CENTER
POT4  (via drill 0.6)
  Top 0.254: POT4.CENTER 38.1,122.94 37.21,123.83 28.7,123.83 26.8,125.73 26.8,194.18 v27.05,194.44
  Bottom 0.254: CPU1.16 27.49,194.88 v27.05,194.44 | C48.2 38.02,122.62 POT4.CENTER
POT5  (via drill 0.6)
  Top 0.254: POT5.CENTER 12.7,106.05 24.77,118.11 24.77,181.99 v24.38,182.37
  Bottom 0.254: v24.38,182.37 24.13,182.63 24.13,187.45 24.64,187.96 24.64,191.39 25.01,191.76 CPU1.23 | C44.2 12.72,97.17 POT5.CENTER
POT6  (via drill 0.6)
  Top 0.254: POT6.CENTER 38.1,97.16 37.47,97.79 37.47,106.55 26.29,117.73 26.29,186.06 v26.04,186.31
  Bottom 0.254: CPU1.20 26.51,191.35 26.16,191.01 26.16,186.44 v26.04,186.31 | C47.2 38.02,97.22 POT6.CENTER
POT7  (via drill 0.6)
  Top 0.254: POT7.CENTER 38.1,95.25 36.96,96.39 36.96,106.43 25.78,117.6 25.78,184.78 v25.53,185.04
  Bottom 0.254: CPU1.21 26.01,191.49 25.65,191.13 25.65,187.32 25.27,186.94 25.27,185.29 v25.53,185.04 | C43.2 POT7.CENTER
ROT1_A  (via drill 0.6)
  Top 0.254: v32.26,167 v28.19,167
  Bottom 0.254: R39.1 C27.1 v32.26,167 | v28.19,167 17.02,167 16.38,166.37 IC4.4
ROT1_B  (via drill 0.6)
  Top 0.254: v41.53,165.1 v28.32,165.1
  Bottom 0.254: R40.1 C28.1 42.25,165.82 v41.53,165.1 | v28.32,165.1 IC4.5
ROT1_SW  (via drill 0.6)
  Top 0.254: v39.88,175.13 v28.57,175.13
  Bottom 0.254: ROT1.S2 40.51,187.25 R6.1 40.51,175.77 v39.88,175.13 | v28.57,175.13 25.4,175.13 17.91,167.64 IC4.3
ROT2_A
  Bottom 0.254: R43.1 6.69,174.88 C29.1 6.35,174.54 6.35,172.97 3.56,170.18 3.56,166.5 4.45,165.61 7.87,165.61 9.65,163.83 IC4.11
ROT2_B
  Bottom 0.254: C30.1 17.02,174.66 R44.1 16.98,172.43 15.62,171.07 12.06,171.07 11.56,170.56 11.56,166.37 10.29,165.1 IC4.12
ROT2_SW
  Bottom 0.254: ROT2.S2 15.11,187.25 R4.1 13.84,184.28 13.84,171.83 13.59,171.58 11.56,171.58 11.05,171.07 11.05,166.62 10.79,166.37 IC4.13
SPI2_CLK  (via drill 0.6)
  Top 0.254: v9.02,190.12 2.29,183.39 2.29,169.93 | v4.7,38.73 4.7,63.25 6.86,65.41 22.35,65.41 22.73,65.79 v22.73,67.56 | v29.59,73.41 29.59,86.23 v29.08,86.74 | 2.29,169.93 2.29,163.45 2.67,163.07 2.67,161.54 1.65,160.53 1.65,127.89 15.11,114.43 16,114.43 v17.75,112.67 | v12.32,168.91 3.3,168.91 2.29,169.93 | v20.83,109.6 21.21,109.22 21.21,88.14 v22.61,86.74
  Bottom 0.254: IC4.2 v12.32,168.91 | v22.61,86.74 IC3.11 v29.08,86.74 | v4.7,38.73 4.7,37.72 | 4.7,37.72 4.7,24.51 5.59,23.62 IC1.11 | IC5.2 4.7,37.72 | v22.73,67.56 22.73,72.01 23.11,72.39 26.42,72.39 IC2.11 28.7,72.52 v29.59,73.41 | CPU1.34 14.28,195.38 v9.02,190.12 | v17.75,112.67 v20.83,109.6
SPI2_MISO  (via drill 0.6)
  Top 0.254: v7.11,190.75 1.14,184.78 1.14,162.69 v1.4,162.43
  Bottom 0.254: CPU1.35 12.24,195.88 v7.11,190.75 | IC4.9 2.54,161.29 v1.4,162.43
SPI2_MOSI  (via drill 0.6)
  Top 0.254: v7.11,191.9 0.64,185.42 0.64,127.25 v15.11,112.78 | v19.81,108.08 19.81,85.47 v22.35,82.93
  Bottom 0.254: CPU1.36 11.59,196.38 v7.11,191.9 | v15.11,112.78 v19.81,108.08 | v22.35,82.93 IC3.14
SPI2_RC1  (via drill 0.6)
  Top 0.254: v5.71,25.53 5.71,63.37 7.11,64.77 22.73,64.77 24.26,66.29 v24.26,70.48 | v24.51,197.1 14.86,197.1 1.65,183.9 1.65,163.32 2.16,162.81 2.16,161.93 1.14,160.91 1.14,127.64 14.99,113.79 15.37,113.79 v16.38,112.78 | v28.7,71.5 28.7,84.96 v28.19,85.47 | v19.56,109.6 20.7,108.46 20.7,87 22.23,85.47 v23.62,85.47
  Bottom 0.254: IC1.12 6.35,24.89 v5.71,25.53 | v24.26,70.48 25.02,71.25 IC2.12 28.45,71.25 v28.7,71.5 | CPU1.11 29.99,197.36 28.96,197.36 28.7,197.1 v24.51,197.1 | v28.19,85.47 IC3.12 v23.62,85.47 | v16.38,112.78 v19.56,109.6
SPI2_RC2  (via drill 0.6)
  Top 0.254: v28.19,197.87 27.18,197.87 24,194.69 24,187.83 21.72,185.55 21.72,174.62 v17.27,170.18 | v0.89,41.66 0.89,96.14 5.33,100.58 v5.33,120.4 | v5.33,126.49 5.33,159.26 7.11,161.04 12.45,161.04 13.72,162.31 13.72,169.8 v14.1,170.18
  Bottom 0.254: CPU1.10 28.21,197.88 v28.19,197.87 | v17.27,170.18 IC4.1 v14.1,170.18 | IC5.1 9.27,36.45 9.78,36.96 9.78,38.1 9.53,38.35 6.6,38.35 4.83,40.13 2.41,40.13 v0.89,41.66 | v5.33,120.4 v5.33,126.49
SWCK  (via drill 0.6)
  Top 0.254: v11.43,202.56 v6.73,197.87
  Bottom 0.254: v6.73,197.87 TC1.4 | CPU1.49 20.51,205.81 19.94,206.38 15.24,206.38 v11.43,202.56
SWDIO  (via drill 0.6)
  Top 0.254: v5.97,196.6 6.86,196.6 10.92,200.66 v11.94,200.66
  Bottom 0.254: CPU1.46 17.86,201.38 17.14,200.66 v11.94,200.66 | v5.97,196.6 TC1.2
UART_RX  (via drill 0.6)
  Top 0.254: v11.68,205.1 v6.99,200.41
  Bottom 0.254: CPU1.52 22.01,206.72 21.34,207.39 13.97,207.39 v11.68,205.1 | v6.99,200.41 TC1.8
UART_TX  (via drill 0.6)
  Top 0.254: v11.56,203.84 6.86,199.14 v5.71,199.14
  Bottom 0.254: v5.71,199.14 TC1.6 | CPU1.51 21.51,206.59 21.21,206.88 14.22,206.88 12.57,205.23 12.57,204.85 v11.56,203.84

### Text on the board
tNames: Designed by: | midimixer-channel rev 2.0 | Eran Rundstein, 2017 | Pulsar Heavy Industries
bNames: GND | H | L | GND | H | L | 5V | 5V
Measures: USER LED MOVED FROM PC5 TO PC12
Document: Button input order changed
tDocu: Switched between the two HC165 parallel->serial registers